# EAGLE design BLE-BMS (EAGLE 7.1.0)
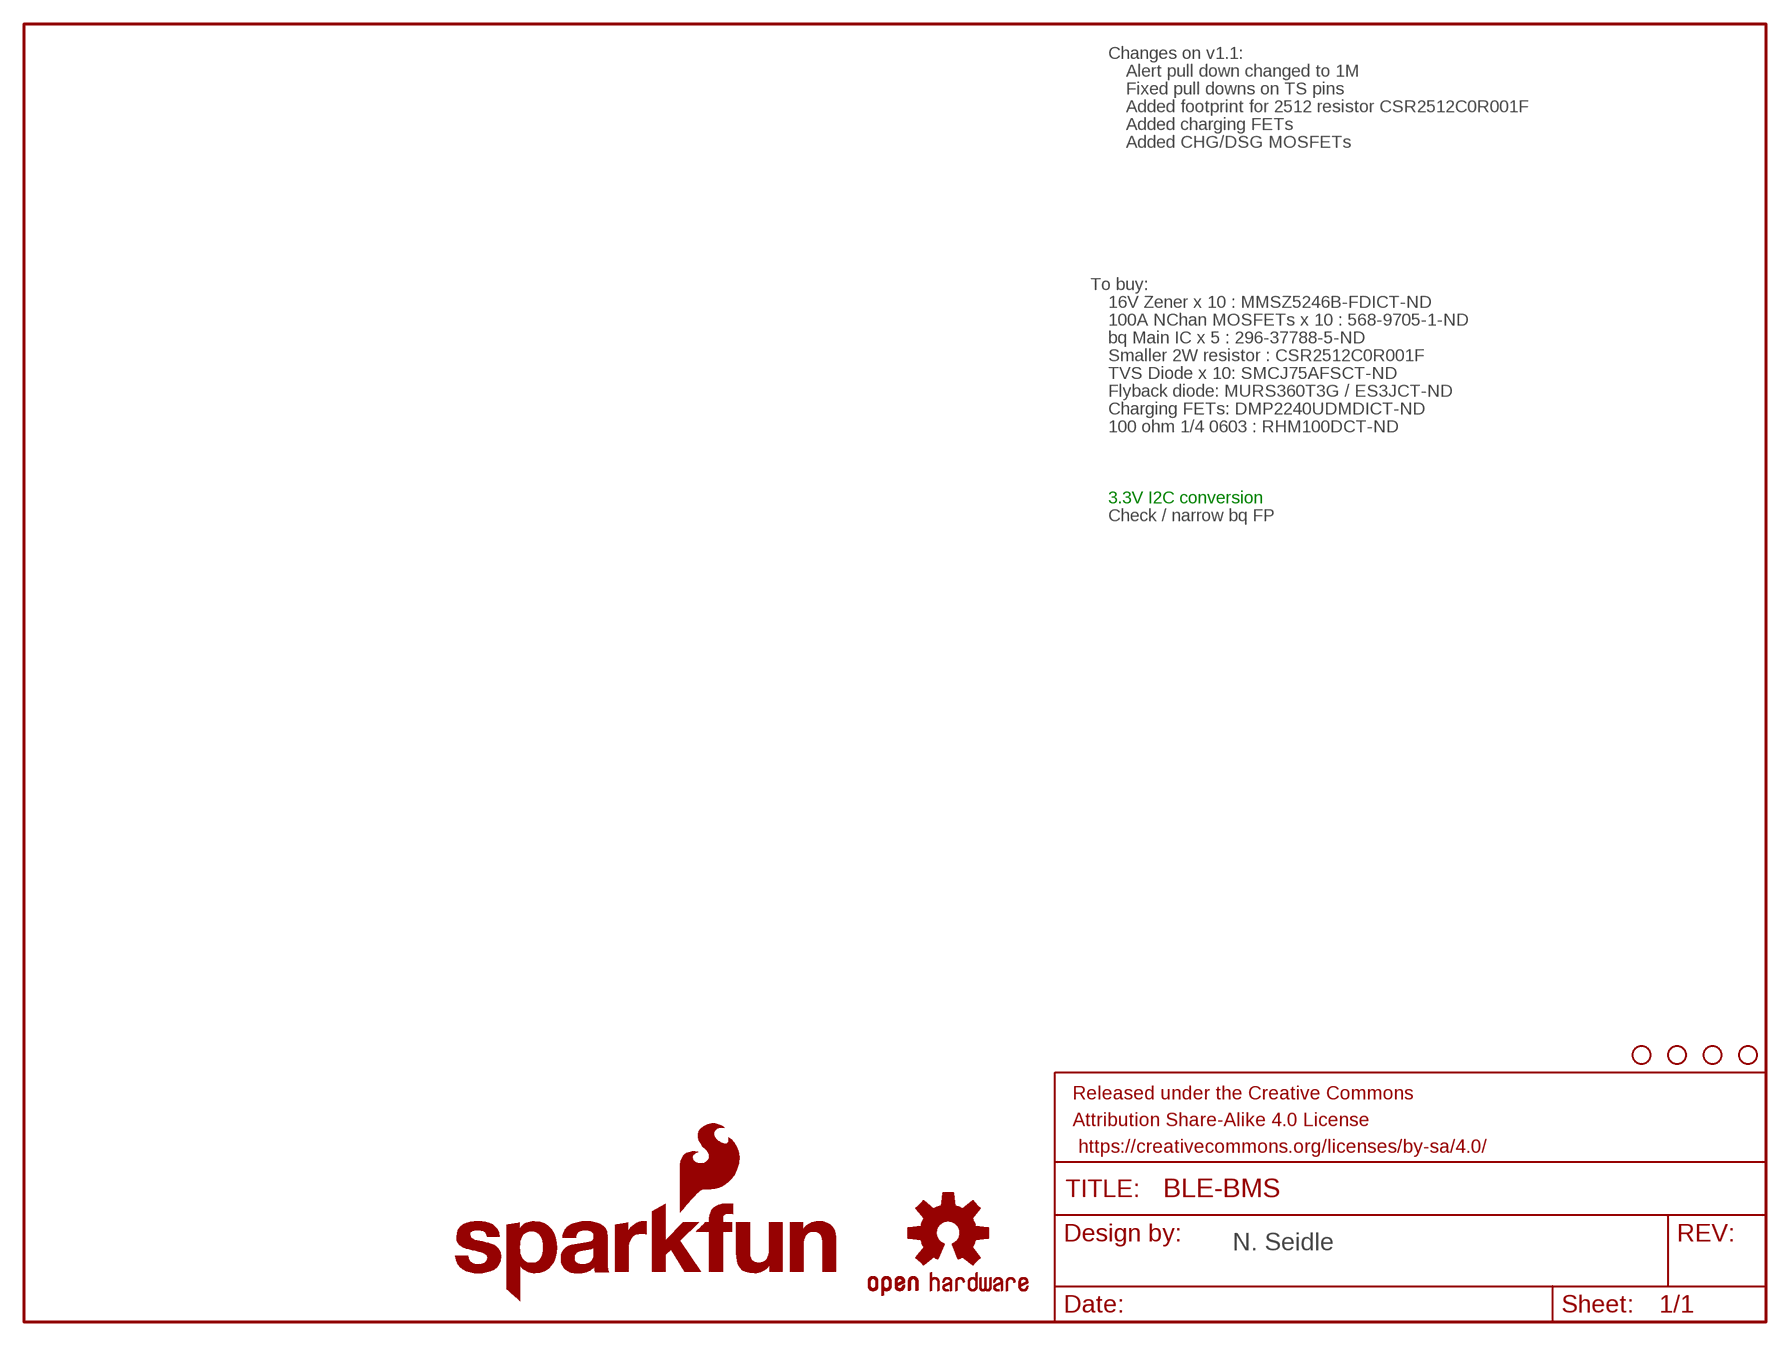
[diagram p0: schematic, sheet 1, part 1 of 3]
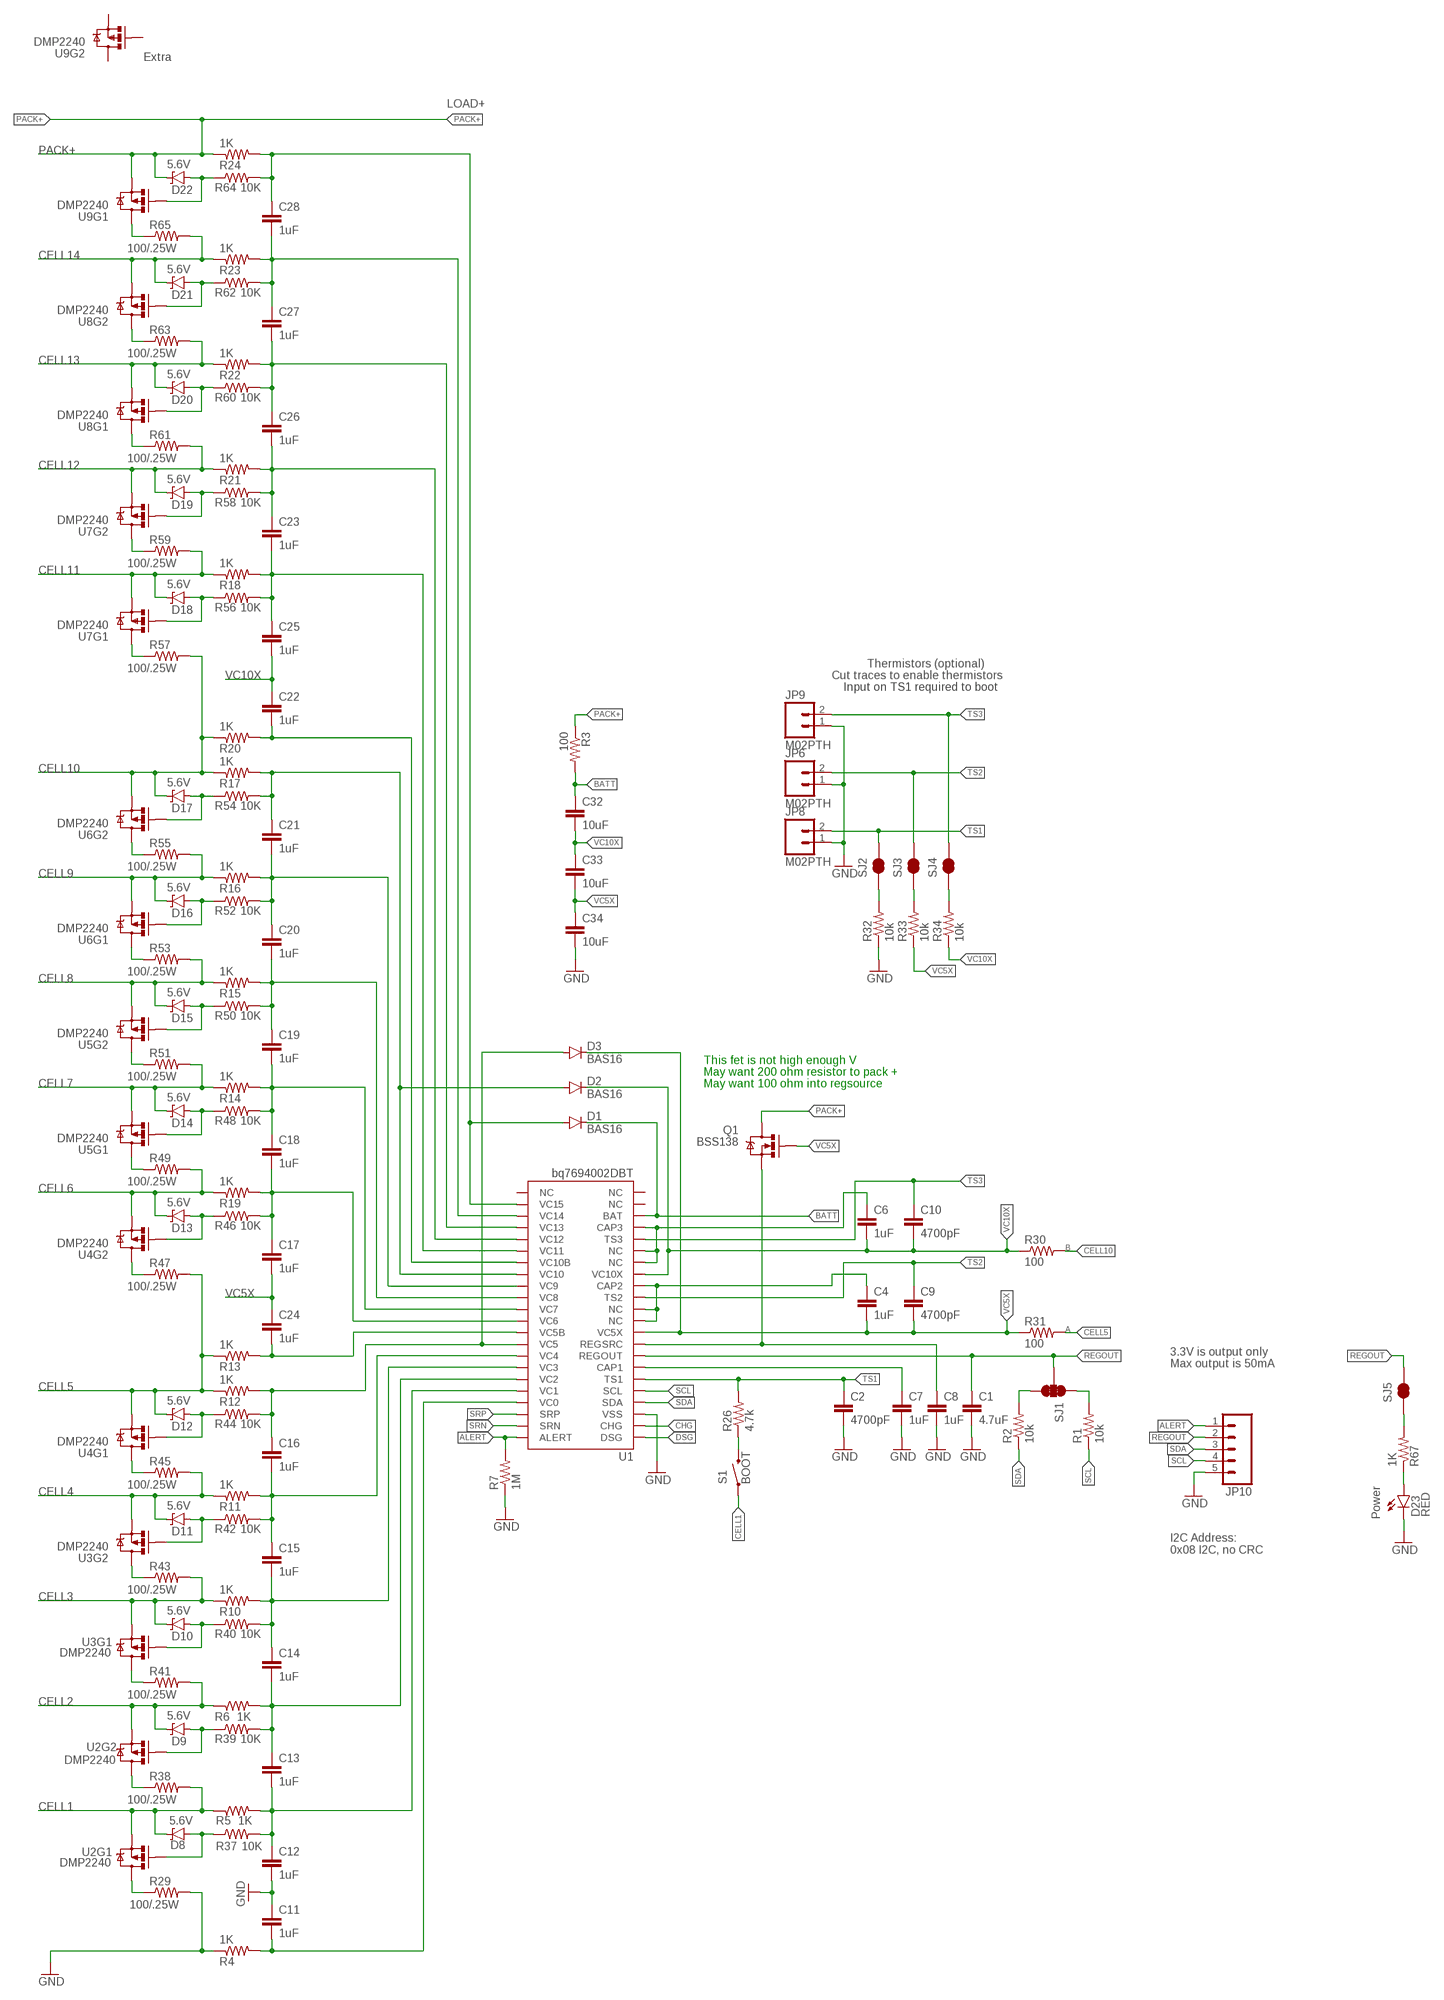
[diagram p1: schematic, sheet 1, part 2 of 3]
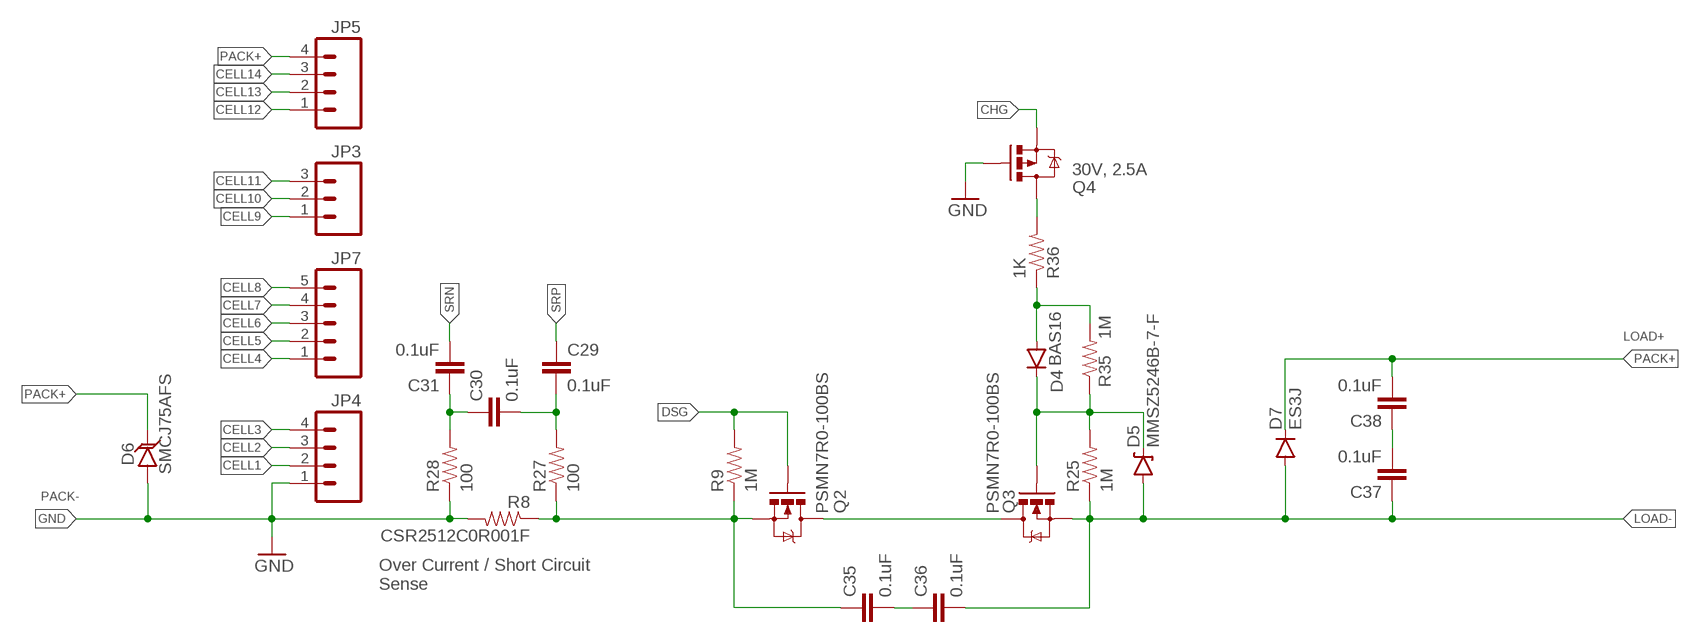
[diagram p2: schematic, sheet 1, part 3 of 3]

## Parts
C1  4.7uF  4.7UF-6.3V-10%(0603)0603  [0603-CAP]
C2  4700pF  4.7NF-50V-10%(0603)  [0603-CAP]
C4  1uF  1.0UF-16V-10%(0603)  [0603-CAP]
C6  1uF  1.0UF-16V-10%(0603)  [0603-CAP]
C7  1uF  1.0UF-16V-10%(0603)  [0603-CAP]
C8  1uF  1.0UF-16V-10%(0603)  [0603-CAP]
C9  4700pF  4.7NF-50V-10%(0603)  [0603-CAP]
C10  4700pF  4.7NF-50V-10%(0603)  [0603-CAP]
C11  1uF  1.0UF-16V-10%(0603)  [0603-CAP]
C12  1uF  1.0UF-16V-10%(0603)  [0603-CAP]
C13  1uF  1.0UF-16V-10%(0603)  [0603-CAP]
C14  1uF  1.0UF-16V-10%(0603)  [0603-CAP]
C15  1uF  1.0UF-16V-10%(0603)  [0603-CAP]
C16  1uF  1.0UF-16V-10%(0603)  [0603-CAP]
C17  1uF  1.0UF-16V-10%(0603)  [0603-CAP]
C18  1uF  1.0UF-16V-10%(0603)  [0603-CAP]
C19  1uF  1.0UF-16V-10%(0603)  [0603-CAP]
C20  1uF  1.0UF-16V-10%(0603)  [0603-CAP]
C21  1uF  1.0UF-16V-10%(0603)  [0603-CAP]
C22  1uF  1.0UF-16V-10%(0603)  [0603-CAP]
C23  1uF  1.0UF-16V-10%(0603)  [0603-CAP]
C24  1uF  1.0UF-16V-10%(0603)  [0603-CAP]
C25  1uF  1.0UF-16V-10%(0603)  [0603-CAP]
C26  1uF  1.0UF-16V-10%(0603)  [0603-CAP]
C27  1uF  1.0UF-16V-10%(0603)  [0603-CAP]
C28  1uF  1.0UF-16V-10%(0603)  [0603-CAP]
C29  0.1uF  0.1UF-25V(+80/-20%)(0603)  [0603-CAP]
C30  0.1uF  0.1UF-25V(+80/-20%)(0603)  [0603-CAP]
C31  0.1uF  0.1UF-25V(+80/-20%)(0603)  [0603-CAP]
C32  10uF  10UF50V20%(1210)  [1210]
C33  10uF  10UF50V20%(1210)  [1210]
C34  10uF  10UF50V20%(1210)  [1210]
C35  0.1uF  0.1UF-100V-10%(0603)  [0603-CAP]
C36  0.1uF  0.1UF-100V-10%(0603)  [0603-CAP]
C37  0.1uF  0.1UF-100V-10%(0603)  [0603-CAP]
C38  0.1uF  0.1UF-100V-10%(0603)  [0603-CAP]
D1  BAS16  DIODESOD  [SOD-323]
D2  BAS16  DIODESOD  [SOD-323]
D3  BAS16  DIODESOD  [SOD-323]
D4  BAS16  DIODESOD  [SOD-323]
D5  MMSZ5246B-7-F  DIODE-ZENERSOD-123  [SOD-123]
D6  SMCJ75AFS  TVSSMC  [SMC]
D7  ES3J  DIODESMC/DO-214AB  [SMC]
D8  5.6V  DIODE-ZENER3.3V  [SOD-323]
D9  5.6V  DIODE-ZENER3.3V  [SOD-323]
D10  5.6V  DIODE-ZENER3.3V  [SOD-323]
D11  5.6V  DIODE-ZENER3.3V  [SOD-323]
D12  5.6V  DIODE-ZENER3.3V  [SOD-323]
D13  5.6V  DIODE-ZENER3.3V  [SOD-323]
D14  5.6V  DIODE-ZENER3.3V  [SOD-323]
D15  5.6V  DIODE-ZENER3.3V  [SOD-323]
D16  5.6V  DIODE-ZENER3.3V  [SOD-323]
D17  5.6V  DIODE-ZENER3.3V  [SOD-323]
D18  5.6V  DIODE-ZENER3.3V  [SOD-323]
D19  5.6V  DIODE-ZENER3.3V  [SOD-323]
D20  5.6V  DIODE-ZENER3.3V  [SOD-323]
D21  5.6V  DIODE-ZENER3.3V  [SOD-323]
D22  5.6V  DIODE-ZENER3.3V  [SOD-323]
D23  RED  LED-RED1206  [LED-1206]
FRAME1  FRAME-LETTER  [CREATIVE_COMMONS]
JP3  M03JST-PTH  [JST-3-PTH]
JP4  M04JST-PTH  [JST-4-PTH]
JP5  M04JST-PTH  [JST-4-PTH]
JP6  M02PTH  [1X02]
JP7  M05JST  [JST-5-PTH]
JP8  M02PTH  [1X02]
JP9  M02PTH  [1X02]
JP10  M05PTH  [1X05]
LOGO1  SFE_LOGO_NAME_FLAME.1_INCH  [SFE_LOGO_NAME_FLAME_.1]
Q1  BSS138  MOSFET-NCHANNELBSS138  [SOT23-3]
Q2  PSMN7R0-100BS  MOSFET-NCHANNELPSMN7R0  [TO-263/D2PAK]
Q3  PSMN7R0-100BS  MOSFET-NCHANNELPSMN7R0  [TO-263/D2PAK]
Q4  30V, 2.5A  MOSFET-PCHANNELDMG2307L  [SOT23-3]
R1  10k  10KOHM1/10W1%(0603)0603  [0603-RES]
R2  10k  10KOHM1/10W1%(0603)0603  [0603-RES]
R3  100  100OHM1/10W1%(0603)  [0603-RES]
R4  1K  1KOHM1/10W1%(0603)  [0603-RES]
R5  1K  1KOHM1/10W1%(0603)  [0603-RES]
R6  1K  1KOHM1/10W1%(0603)  [0603-RES]
R7  1M  1MOHM1/10W1%(0603)  [0603-RES]
R8  CSR2512C0R001F  RESISTOR2512  [2512]
R9  1M  1MOHM1/10W1%(0603)  [0603-RES]
R10  1K  1KOHM1/10W1%(0603)  [0603-RES]
R11  1K  1KOHM1/10W1%(0603)  [0603-RES]
R12  1K  1KOHM1/10W1%(0603)  [0603-RES]
R13  1K  1KOHM1/10W1%(0603)  [0603-RES]
R14  1K  1KOHM1/10W1%(0603)  [0603-RES]
R15  1K  1KOHM1/10W1%(0603)  [0603-RES]
R16  1K  1KOHM1/10W1%(0603)  [0603-RES]
R17  1K  1KOHM1/10W1%(0603)  [0603-RES]
R18  1K  1KOHM1/10W1%(0603)  [0603-RES]
R19  1K  1KOHM1/10W1%(0603)  [0603-RES]
R20  1K  1KOHM1/10W1%(0603)  [0603-RES]
R21  1K  1KOHM1/10W1%(0603)  [0603-RES]
R22  1K  1KOHM1/10W1%(0603)  [0603-RES]
R23  1K  1KOHM1/10W1%(0603)  [0603-RES]
R24  1K  1KOHM1/10W1%(0603)  [0603-RES]
R25  1M  1MOHM1/10W1%(0603)  [0603-RES]
R26  4.7k  4.7KOHM1/10W1%(0603)  [0603-RES]
R27  100  100OHM1/10W1%(0603)  [0603-RES]
R28  100  100OHM1/10W1%(0603)  [0603-RES]
R29  100/.25W  100OHM1/10W1%(0603)  [0603-RES]
R30  100  100OHM1/10W1%(0603)  [0603-RES]
R31  100  100OHM1/10W1%(0603)  [0603-RES]
R32  10k  10KOHM1/10W1%(0603)0603  [0603-RES]
R33  10k  10KOHM1/10W1%(0603)0603  [0603-RES]
R34  10k  10KOHM1/10W1%(0603)0603  [0603-RES]
R35  1M  1MOHM1/10W1%(0603)  [0603-RES]
R36  1K  1KOHM1/10W1%(0603)  [0603-RES]
R37  10K  10KOHM1/10W1%(0603)0603  [0603-RES]
R38  100/.25W  100OHM1/10W1%(0603)  [0603-RES]
R39  10K  10KOHM1/10W1%(0603)0603  [0603-RES]
R40  10K  10KOHM1/10W1%(0603)0603  [0603-RES]
R41  100/.25W  100OHM1/10W1%(0603)  [0603-RES]
R42  10K  10KOHM1/10W1%(0603)0603  [0603-RES]
R43  100/.25W  100OHM1/10W1%(0603)  [0603-RES]
R44  10K  10KOHM1/10W1%(0603)0603  [0603-RES]
R45  100/.25W  100OHM1/10W1%(0603)  [0603-RES]
R46  10K  10KOHM1/10W1%(0603)0603  [0603-RES]
R47  100/.25W  100OHM1/10W1%(0603)  [0603-RES]
R48  10K  10KOHM1/10W1%(0603)0603  [0603-RES]
R49  100/.25W  100OHM1/10W1%(0603)  [0603-RES]
R50  10K  10KOHM1/10W1%(0603)0603  [0603-RES]
R51  100/.25W  100OHM1/10W1%(0603)  [0603-RES]
R52  10K  10KOHM1/10W1%(0603)0603  [0603-RES]
R53  100/.25W  100OHM1/10W1%(0603)  [0603-RES]
R54  10K  10KOHM1/10W1%(0603)0603  [0603-RES]
R55  100/.25W  100OHM1/10W1%(0603)  [0603-RES]
R56  10K  10KOHM1/10W1%(0603)0603  [0603-RES]
R57  100/.25W  100OHM1/10W1%(0603)  [0603-RES]
R58  10K  10KOHM1/10W1%(0603)0603  [0603-RES]
R59  100/.25W  100OHM1/10W1%(0603)  [0603-RES]
R60  10K  10KOHM1/10W1%(0603)0603  [0603-RES]
R61  100/.25W  100OHM1/10W1%(0603)  [0603-RES]
R62  10K  10KOHM1/10W1%(0603)0603  [0603-RES]
R63  100/.25W  100OHM1/10W1%(0603)  [0603-RES]
R64  10K  10KOHM1/10W1%(0603)0603  [0603-RES]
R65  100/.25W  100OHM1/10W1%(0603)  [0603-RES]
R67  1K  1KOHM1/10W1%(0603)  [0603-RES]
S1  BOOT  SWITCH-MOMENTARY-2-SMD-1101NE  [TACTILE-SWITCH-1101NE]
SJ1  JUMPER-PAD-3-NC_BY_TRACE  [PAD-JUMPER-3-3OF3_NC_BY_TRACE_YES_SILK_FULL_BOX]
SJ2  JUMPER-PAD-2-NC_BY_TRACE  [PAD-JUMPER-2-NC_BY_TRACE_YES_SILK]
SJ3  JUMPER-PAD-2-NC_BY_TRACE  [PAD-JUMPER-2-NC_BY_TRACE_YES_SILK]
SJ4  JUMPER-PAD-2-NC_BY_TRACE  [PAD-JUMPER-2-NC_BY_TRACE_YES_SILK]
SJ5  JUMPER-PAD-2-NC_BY_TRACE  [PAD-JUMPER-2-NC_BY_TRACE_YES_SILK]
STANDOFF1  STAND-OFF  [STAND-OFF]
STANDOFF2  STAND-OFF  [STAND-OFF]
STANDOFF3  STAND-OFF  [STAND-OFF]
STANDOFF4  STAND-OFF  [STAND-OFF]
U1  bq7694002DBT  BQ7694040  [44-TSSOP]
U2  DMP2240  MOSFET-PCHANNEL_DUALSOT26  [SOT26]
U3  DMP2240  MOSFET-PCHANNEL_DUALSOT26  [SOT26]
U4  DMP2240  MOSFET-PCHANNEL_DUALSOT26  [SOT26]
U5  DMP2240  MOSFET-PCHANNEL_DUALSOT26  [SOT26]
U6  DMP2240  MOSFET-PCHANNEL_DUALSOT26  [SOT26]
U7  DMP2240  MOSFET-PCHANNEL_DUALSOT26  [SOT26]
U8  DMP2240  MOSFET-PCHANNEL_DUALSOT26  [SOT26]
U9  DMP2240  MOSFET-PCHANNEL_DUALSOT26  [SOT26]
U$7  OSHW-LOGOS  [OSHW-LOGO-S]

## Nets
ALERT: JP10.1 R7.2 U1.44(ALERT)
BATT: C32.1 D1.C R3.2 U1.20(BAT)
CAP2: C4.1 U1.11(NC) U1.12(NC) U1.14(CAP2)
CAP3: C6.1 U1.16(NC) U1.17(NC) U1.19(CAP3)
CELL1: D8.C JP4.2 R5.1 R38.2 S1.1 U2.S1(S)
CELL2: D9.C JP4.3 R6.1 R41.2 U2.S2(S)
CELL3: D10.C JP4.4 R10.1 R43.2 U3.S1(S)
CELL4: D11.C JP7.1 R11.1 R45.2 U3.S2(S)
CELL5: D12.C JP7.2 R12.1 R13.1 R31.2 R47.2 U4.S1(S)
CELL6: D13.C JP7.3 R19.1 R49.2 U4.S2(S)
CELL7: D14.C JP7.4 R14.1 R51.2 U5.S1(S)
CELL8: D15.C JP7.5 R15.1 R53.2 U5.S2(S)
CELL9: D16.C JP3.1 R16.1 R55.2 U6.S1(S)
CELL10: D17.C JP3.2 R17.1 R20.1 R30.2 R57.2 U6.S2(S)
CELL11: D18.C JP3.3 R18.1 R59.2 U7.S1(S)
CELL12: D19.C JP5.1 R21.1 R61.2 U7.S2(S)
CELL13: D20.C JP5.2 R22.1 R63.2 U8.S1(S)
CELL14: D21.C JP5.3 R23.1 R65.2 U8.S2(S)
CHG: Q4.2(S) U1.2(CHG)
CHG_CTL: D4.C D5.C Q3.1(G) R25.2 R35.1
DSG: Q2.1(G) R9.2 U1.1(DSG)
GND: C1.2 C2.2 C7.2 C8.2 C11.1 C12.2 C34.2 D6.A D23.C JP4.1 JP6.1 JP8.1 JP9.1 JP10.5 Q4.1(G) R4.1 R7.1 R8.2 R28.1 R29.2 R32.1 U1.3(VSS)
LOAD1: Q2.2(D) Q3.2(D)
LOAD2: C35.1 Q2.3(S) R8.1 R9.1 R27.1
LOAD-: C36.2 C37.1 D5.A D7.A Q3.3(S) R25.1
N$1: D8.A R37.1 U2.G1(G)
N$2: Q4.3(D) R36.2
N$3: R32.2 SJ2.1
N$4: R29.1 U2.D1(D)
N$5: D9.A R39.1 U2.G2(G)
N$6: C35.2 C36.1
N$7: D4.A R35.2 R36.1
N$8: R38.1 U2.D2(D)
N$9: C37.2 C38.1
N$10: R2.2 SJ1.3
N$11: R1.2 SJ1.1
N$12: D10.A R40.1 U3.G1(G)
N$13: R41.1 U3.D1(D)
N$14: D11.A R42.1 U3.G2(G)
N$16: R43.1 U3.D2(D)
N$18: D12.A R44.1 U4.G1(G)
N$19: R45.1 U4.D1(D)
N$20: D13.A R46.1 U4.G2(G)
N$21: R47.1 U4.D2(D)
N$23: R49.1 U5.D1(D)
N$25: D14.A R48.1 U5.G1(G)
N$26: R51.1 U5.D2(D)
N$27: D15.A R50.1 U5.G2(G)
N$28: R33.2 SJ3.1
N$30: C7.1 U1.7(CAP1)
N$32: R26.1 S1.2
N$33: R34.2 SJ4.1
N$34: C29.2 C30.2 R27.2
N$35: C30.1 C31.1 R28.2
N$37: R53.1 U6.D1(D)
N$38: D16.A R52.1 U6.G1(G)
N$39: D17.A R54.1 U6.G2(G)
N$41: R55.1 U6.D2(D)
N$42: D18.A R56.1 U7.G1(G)
N$43: R57.1 U7.D1(D)
N$44: D19.A R58.1 U7.G2(G)
N$46: R59.1 U7.D2(D)
N$47: D20.A R60.1 U8.G1(G)
N$50: R61.1 U8.D1(D)
N$51: D21.A R62.1 U8.G2(G)
N$52: R63.1 U8.D2(D)
N$53: D22.A R64.1 U9.G1(G)
N$54: R65.1 U9.D1(D)
N$57: D23.A R67.1
N$58: R67.2 SJ5.1
PACK+: C38.2 D6.C D7.C D22.C JP5.4 Q1.3(D) R3.1 R24.1 U9.S1(S)
REGOUT: C1.1 JP10.2 SJ1.2 SJ5.2 U1.8(REGOUT)
REGSRC: C8.1 Q1.2(S) U1.9(REGSRC)
SCL: JP10.4 R1.1 U1.5(SCL)
SDA: JP10.3 R2.1 U1.4(SDA)
SRN: C31.2 U1.43(SRN)
SRP: C29.1 U1.42(SRP)
TS1: C2.1 JP8.2 R26.2 SJ2.2 U1.6(TS1)
TS2: C9.1 JP6.2 SJ3.2 U1.13(TS2)
TS3: C10.1 JP9.2 SJ4.2 U1.18(TS3)
VC0: C11.2 R4.2 U1.41(VC0)
VC1: C12.1 C13.2 R5.2 R37.2 U1.40(VC1)
VC2: C13.1 C14.2 R6.2 R39.2 U1.39(VC2)
VC3: C14.1 C15.2 R10.2 R40.2 U1.38(VC3)
VC4: C15.1 C16.2 R11.2 R42.2 U1.37(VC4)
VC5: C16.1 D3.A R12.2 R44.2 U1.36(VC5)
VC5B: C24.2 R13.2 U1.35(VC5B)
VC5X: C4.2 C9.2 C17.2 C24.1 C33.2 C34.1 D3.C Q1.1(G) R31.1 R33.1 U1.10(VC5X)
VC6: C17.1 C18.2 R19.2 R46.2 U1.34(VC6)
VC7: C18.1 C19.2 R14.2 R48.2 U1.33(VC7)
VC8: C19.1 C20.2 R15.2 R50.2 U1.32(VC8)
VC9: C20.1 C21.2 R16.2 R52.2 U1.31(VC9)
VC10: C21.1 D2.A R17.2 R54.2 U1.30(VC10)
VC10B: C22.2 R20.2 U1.29(VC10B)
VC10X: C6.2 C10.2 C22.1 C25.2 C32.2 C33.1 D2.C R30.1 R34.1 U1.15(VC10X)
VC11: C23.2 C25.1 R18.2 R56.2 U1.28(VC11)
VC12: C23.1 C26.2 R21.2 R58.2 U1.27(VC12)
VC13: C26.1 C27.2 R22.2 R60.2 U1.26(VC13)
VC14: C27.1 C28.2 R23.2 R62.2 U1.25(VC14)
VC15: C28.1 D1.A R24.2 R64.2 U1.24(VC15)
Unconnected: U1.21(NC) U1.22(NC) U1.23(NC) U9.D2(D) U9.G2(G) U9.S2(S)

## Notes on the sheet
- Extra
- LOAD+
- Thermistors (optional)
- Cut traces to enable thermistors
- Input on TS1 required to boot
- This fet is not high enough V
- May want 200 ohm resistor to pack +
- May want 100 ohm into regsource
- B
- A
- 3.3V is output only
- Max output is 50mA
- Power
- I2C Address:
  0x08 I2C, no CRC
- Changes on v1.1:
- Alert pull down changed to 1M
- Fixed pull downs on TS pins
- Added footprint for 2512 resistor CSR2512C0R001F
- Added charging FETs
- Added CHG/DSG MOSFETs
- To buy:
- 16V Zener x 10 : MMSZ5246B-FDICT-ND
- 100A NChan MOSFETs x 10 : 568-9705-1-ND
- bq Main IC x 5 : 296-37788-5-ND
- Smaller 2W resistor : CSR2512C0R001F
- TVS Diode x 10: SMCJ75AFSCT-ND
- Flyback diode: MURS360T3G / ES3JCT-ND
- Charging FETs: DMP2240UDMDICT-ND
- 100 ohm 1/4 0603 : RHM100DCT-ND
- 3.3V I2C conversion
- Check / narrow bq FP
- LOAD+
- PACK-
- Over Current / Short Circuit
  Sense
- N. Seidle

## Library data of the parts
C1 = SparkFun-Capacitors:4.7UF-6.3V-10%(0603): CAP-08280; PROD_ID: CAP-08280
C2 C9 C10 = SparkFun-Capacitors:4.7NF-50V-10%(0603): CAP-11378; PROD_ID: CAP-11378; VALUE: 4.7nF
C4 C6-C8 C11-C28 = SparkFun-Capacitors:1.0UF-16V-10%(0603): CAP-00868; PROD_ID: CAP-00868; VALUE: 1.0uF
C29-C31 = SparkFun-Capacitors:0.1UF-25V(+80/-20%)(0603): CAP-00810 Ceramic Standard decoupling cap; PROD_ID: CAP-00810
C32-C34 = SparkFun-Capacitors:10UF50V20%(1210): CAP-09824; PROD_ID: CAP-09824
C35-C38 = SparkFun-Capacitors:0.1UF-100V-10%(0603): CAP-08390; PROD_ID: CAP-08390
D1-D4 = SparkFun-DiscreteSemi:DIODE: Diode These are standard reverse protection diodes and small signal diodes. SMA package can handle up to about 1A. SOD-323 can handle about 200mA. What the SOD-323 package when ordering, there are some mfgs out there that are 5-pin packages.; PROD_ID: DIO-09646
D5 = SparkFun-DiscreteSemi:DIODE-ZENER: Zener Diode Production Part - 8199 3.4V Zener Voltage
D6 = SparkFun-DiscreteSemi:TVS: Transient voltage suppressor- prevents ESD on inputs.
D7 = SparkFun-DiscreteSemi:DIODE: Diode These are standard reverse protection diodes and small signal diodes. SMA package can handle up to about 1A. SOD-323 can handle about 200mA. What the SOD-323 package when ordering, there are some mfgs out there that are 5-pin packages.
D8-D22 = SparkFun-DiscreteSemi:DIODE-ZENER: Zener Diode Production Part - 8199 3.4V Zener Voltage; PROD_ID: DIO-11284; VALUE: 3.3V
D23 = SparkFun-LED:LED-RED: Assorted Red LEDs LilyPad 1206- DIO-09912 1206- DIO-00809 0603- DIO-00819; PROD_ID: DIO-00809
FRAME1 = SparkFun-Aesthetics:FRAME-LETTER: Schematic Frame Standard 8.5x11 US Letter frame
JP3 = SparkFun-Connectors:M03: Header 3 Standard 3-pin 0.1" header. Use with straight break away headers (SKU : PRT-00116), right angle break away headers (PRT-00553), swiss pins (PRT-00743), machine pins (PRT-00117), and female headers (PRT-00115). Molex polarized connector foot print use with SKU : PRT-08232 with associated crimp pins and housings.; SKU: PRT-09915
JP4 JP5 = SparkFun-Connectors:M04: Header 4 Standard 4-pin 0.1" header. Use with straight break away headers (SKU : PRT-00116), right angle break away headers (PRT-00553), swiss pins (PRT-00743), machine pins (PRT-00117), and female headers (PRT-00115). Molex polarized connector foot print use with SKU : PRT-08231 with associated crimp pins and housings. 1MM SMD Version SKU: PRT-10208; SKU: PRT-09916
JP6 JP8 JP9 = SparkFun-Connectors:M02: Standard 2-pin 0.1" header. Use with - straight break away headers ( PRT-00116) - right angle break away headers (PRT-00553) - swiss pins (PRT-00743) - machine pins (PRT-00117) - female headers (PRT-00115) Molex polarized connector foot print use with: PRT-08233 with associated crimp pins and housings. 2.54_SCREWTERM for use with PRT-10571. 3.5mm Screw Terminal footprints for PRT-08084 5mm Screw Terminal footprints for use with PRT-08432
JP7 JP10 = SparkFun-Connectors:M05: Header 5 Standard 5-pin 0.1" header. Use with straight break away headers (SKU : PRT-00116), right angle break away headers (PRT-00553), swiss pins (PRT-00743), machine pins (PRT-00117), and female headers (PRT-00115). Molex polarized connector foot print use with SKU : PRT-08230 with associated crimp pins and housings.
LOGO1 = SparkFun-Aesthetics:SFE_LOGO_NAME_FLAME: SFE Logo, name and flame This is the SparkFun full logo. The logo on the schematic will always be the same size; the package variant is the height of the flame part of the logo. Default layer for the logo on the board is tSilk.
Q1 = SparkFun-DiscreteSemi:MOSFET-NCHANNEL: Common NMOSFET Parts MFG P/N Store ID Prod ID FDD8780 TRANS-09984 SI7820DN TRANS-11055 FDS6630A IC-08089 2N7002PW TRANS-11151 FQP30N06L COM-10213 TRANS-10060 BSS123LT1G TRANS-08345 BSS138 TRANS-00830 BS170 2N7000; PROD_ID: TRANS-00830
Q2 Q3 = SparkFun-DiscreteSemi:MOSFET-NCHANNEL: Common NMOSFET Parts MFG P/N Store ID Prod ID FDD8780 TRANS-09984 SI7820DN TRANS-11055 FDS6630A IC-08089 2N7002PW TRANS-11151 FQP30N06L COM-10213 TRANS-10060 BSS123LT1G TRANS-08345 BSS138 TRANS-00830 BS170 2N7000
Q4 = SparkFun-DiscreteSemi:MOSFET-PCHANNEL: Generic PMOSFET IRLML2244 - TRANS-11153 (SOT-23 -20V -4.3A) (1.Gate 2.Source 3.Drain) FQP27P06 - COM-10349 <http://www.sparkfun.com/products/10349> (TO-220 -60V -27A) (1.Gate 2.Source 3.Drain); PROD_ID: TRANS-11308
R1 R2 R32-R34 = SparkFun-Resistors:10KOHM1/10W1%(0603): RES-00824; PROD_ID: RES-00824; VALUE: 10K
R3 R27 R28 R30 R31 = SparkFun-Resistors:100OHM1/10W1%(0603): RES-07863; PROD_ID: RES-07863
R4-R6 R10-R24 R36 R67 = SparkFun-Resistors:1KOHM1/10W1%(0603): RES-07856; PROD_ID: RES-07856
R7 R9 R25 R35 = SparkFun-Resistors:1MOHM1/10W1%(0603): RES-07868; PROD_ID: RES-07868
R8 = bq769x0:RESISTOR
R26 = SparkFun-Resistors:4.7KOHM1/10W1%(0603): RES-07857; PROD_ID: RES-07857; VALUE: 4.7K
R29 R38 R41 R43 R45 R47 R49 R51 R53 R55 R57 R59 R61 R63 R65 = SparkFun-Resistors:100OHM1/10W1%(0603): RES-07863; PROD_ID: RES-07863; VALUE: 100
R37 R39 R40 R42 R44 R46 R48 R50 R52 R54 R56 R58 R60 R62 R64 = SparkFun-Resistors:10KOHM1/10W1%(0603): RES-00824; PROD_ID: RES-00824
S1 = SparkFun-Electromechanical:SWITCH-MOMENTARY-2: Various NO switches- pushbuttons, reed, etc
SJ1 = SparkFun-Passives:JUMPER-PAD-3-NC_BY_TRACE
SJ2-SJ5 = SparkFun-Passives:JUMPER-PAD-2-NC_BY_TRACE
STANDOFF1-STANDOFF4 = SparkFun-Electromechanical:STAND-OFF: #4 Stand Off This is the mechanical footprint for a #4 phillips button head screw. Use the keepout ring to avoid running the screw head into surrounding components. SKU : PRT-00447
U1 = bq769x0:BQ76940: Description: bq769x0 from TI is a multi-cell battery monitoring chipset. It's fairly complex but has lots of useful features. Currently footprint and symbol are unproven.
U2-U9 = SparkFun-DiscreteSemi:MOSFET-PCHANNEL_DUAL
U$7 = SparkFun-Aesthetics:OSHW-LOGO: Open Source Hardware Logo This logo indicates the piece of hardware it is found on incorporates a OSHW license and/or adheres to the definition of open source hardware found here: http://freedomdefined.org/OSHW

## Net classes
1 LOAD1: width 1.27 mm
2 LOAD2: width 1.27 mm
3 LOAD-: width 1.27 mm

## Board
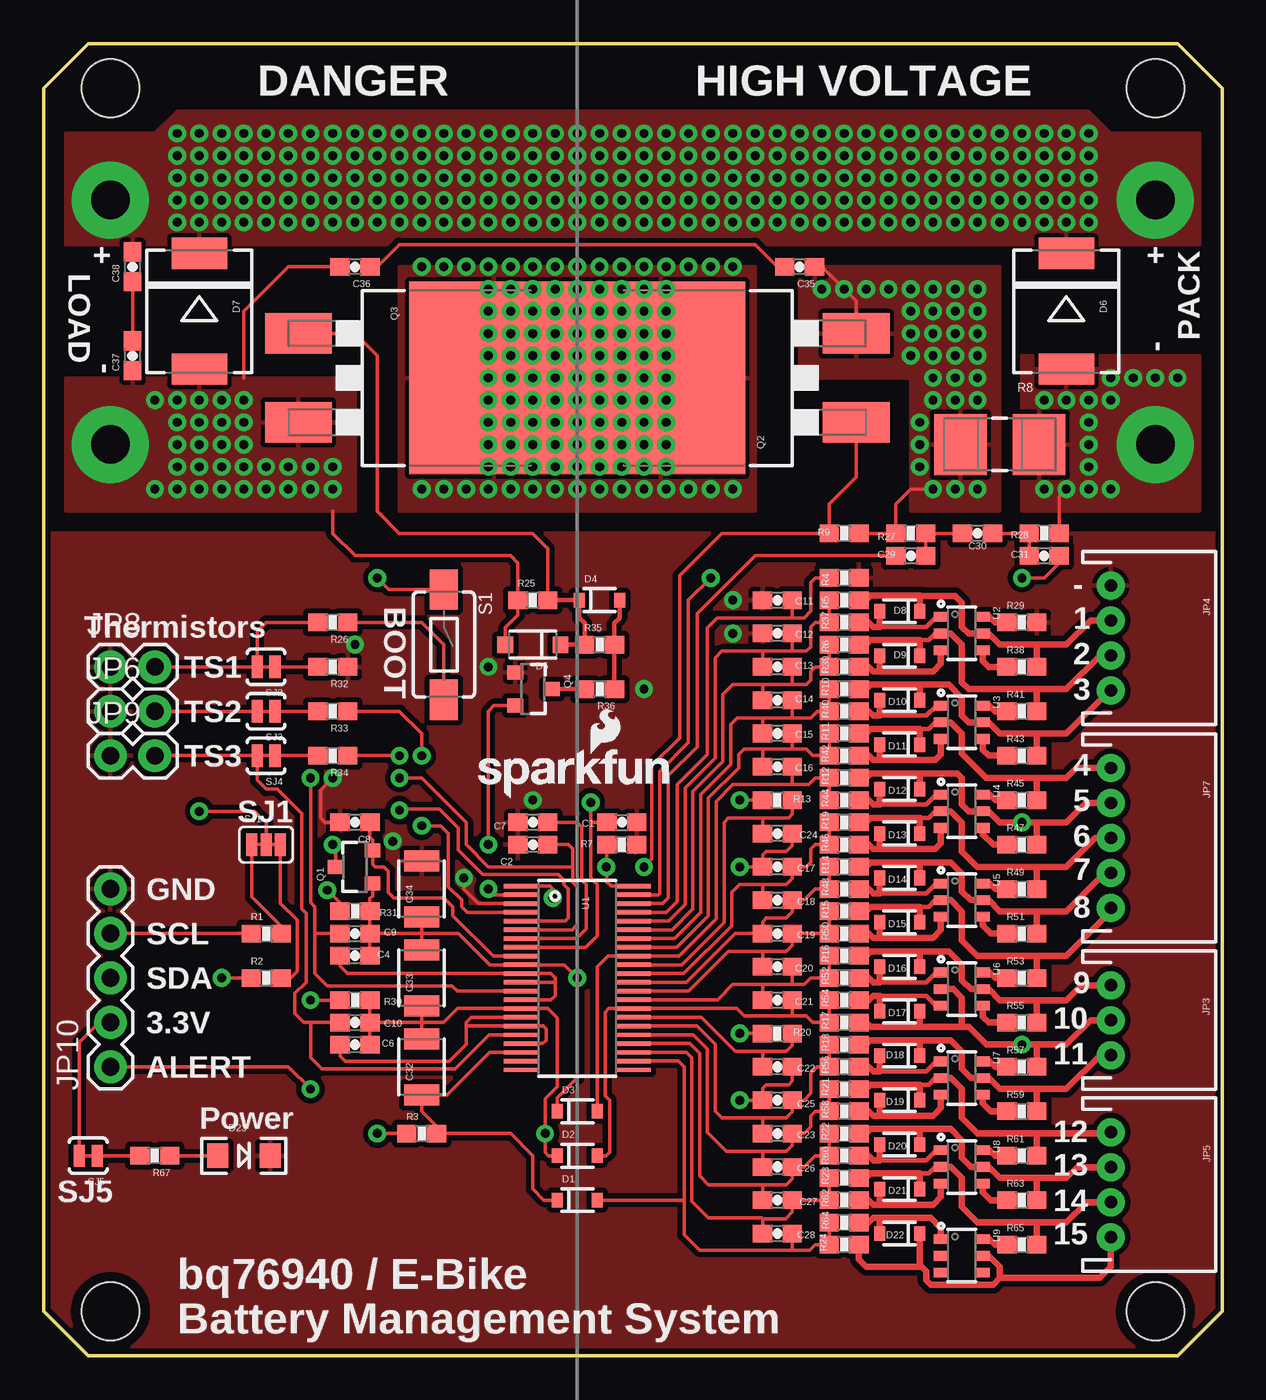
[diagram p3: board, top side]
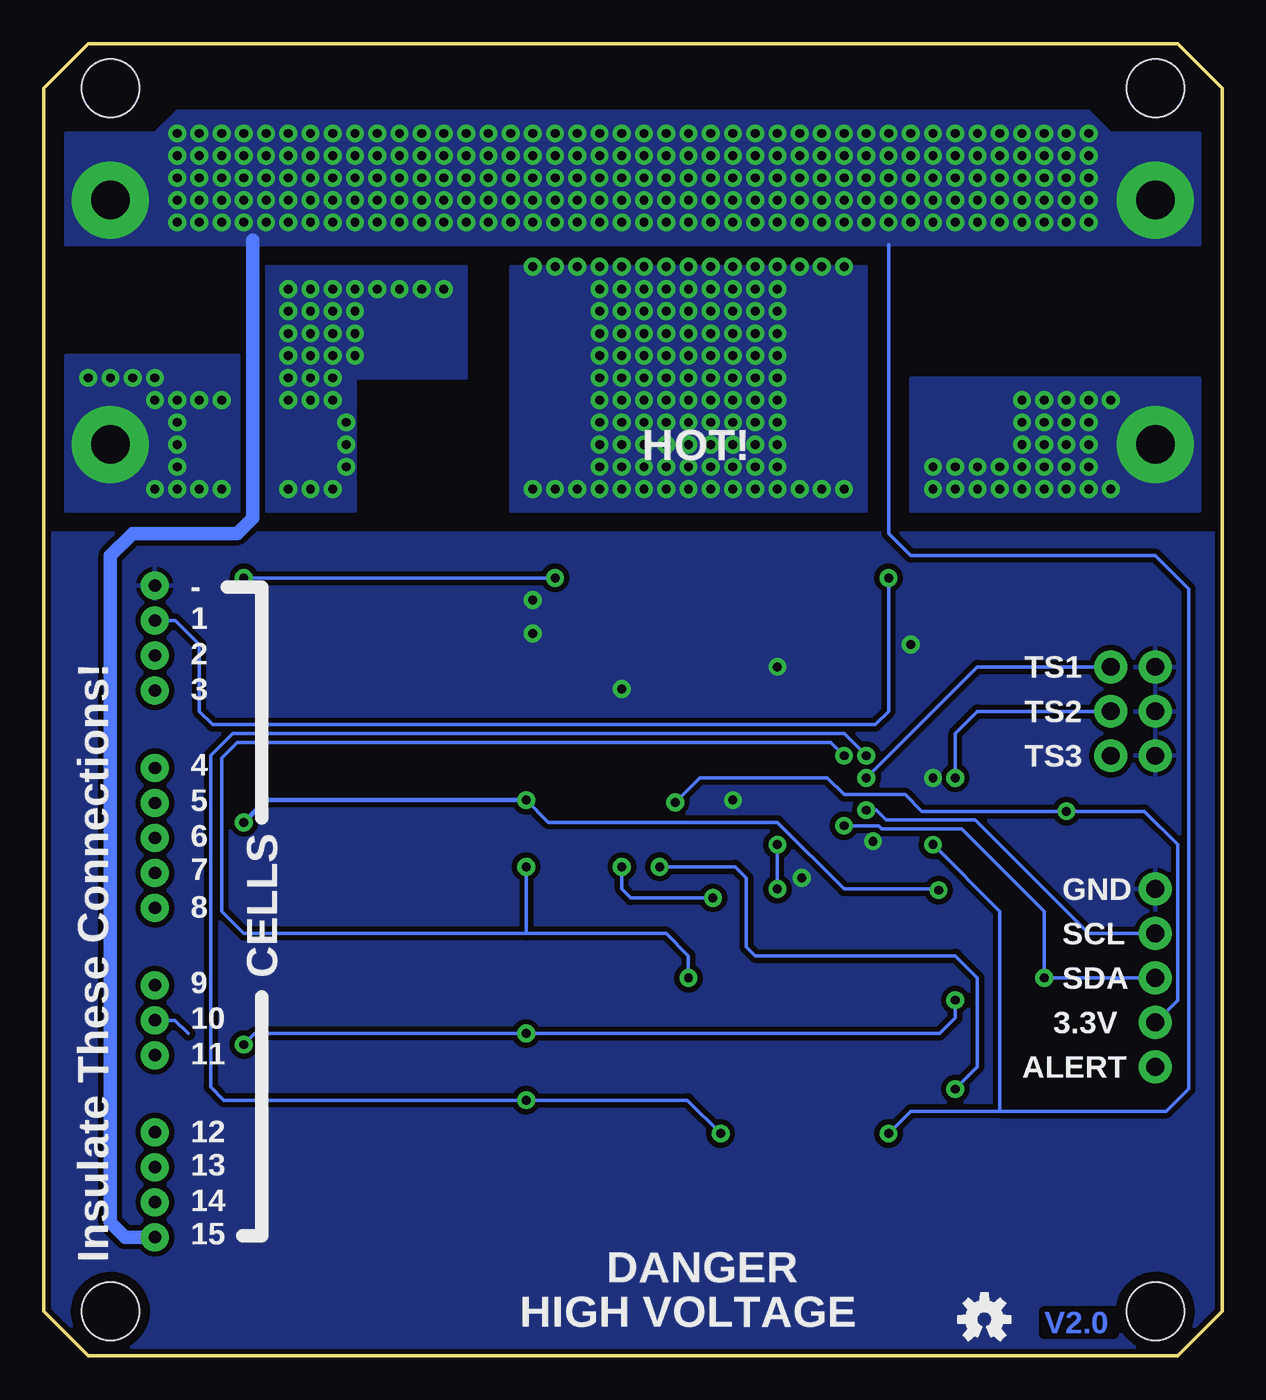
[diagram p4: board, bottom side, seen from below]

Size 67.31 x 74.98 mm. Coordinates in mm from the lower left corner, seen from the top.
Outline: 0,72.44 2.54,74.98 64.77,74.98 67.31,72.44 67.31,2.54 64.77,0 2.54,0 0,2.54 0,72.44
Copper layers (1*16): Top 0.035mm / dielectric 1.5mm / Bottom 0.035mm
Design rules "default *": minimum track width 8mil, minimum drill 20mil, track to track 8mil, track to pad 8mil, pad to pad 8mil, via to via 8mil, smd to smd 8mil, copper to edge 8mil, drill to drill 8mil, minimum pad ring 12mil, minimum via ring 10mil, stop-mask expansion 4mil, vias tented up to drill 20mil, thermal gap 10mil

### Footprints (pad centres in the part's own frame; a part is rotated, then mirrored left to right if it is on the bottom)
0603-CAP = smd 1.1 x 1: 1 -0.85,0; 2 0.85,0
1210 = smd 1.2 x 2: 1 -1.6,0; 2 1.6,0
SOD-323 = smd 0.63 x 0.83: A 1.15,0; C -1.15,0
SOD-123 = smd 0.9 x 0.95: A 1.575,0; C -1.575,0
SMC = smd 1.778 x 3.175: A 3.302,0; C -3.302,0
LED-1206 = smd 1.2 x 1.4: A -1.5,0; C 1.5,0
JST-3-PTH = drill 0.7 pad 1.6: 1 -2,0; 2 0,0; 3 2,0
JST-4-PTH = drill 0.7 pad 1.6: 1 -3,0; 2 -1,0; 3 1,0; 4 3,0
1X02 = drill 1.016 pad 1.88: 1 0,0; 2 2.54,0
JST-5-PTH = drill 0.7 pad 1.6: 1 -4,0; 2 -2,0; 3 0,0; 4 2,0; 5 4,0
1X05 = drill 1.016 pad 1.88: 1 0,0; 2 2.54,0; 3 5.08,0; 4 7.62,0; 5 10.16,0
SOT23-3 = smd 0.8 x 0.9: 1 -0.95,-1; 2 0.95,-1; 3 0,1.1
TO-263/D2PAK = smd 2.32 x 3.81: 1 -2.54,-7.045; 3 2.54,-7.045 | smd 11 x 9.65: 2 0,4.125
0603-RES = smd 1.1 x 1: 1 -0.85,0; 2 0.85,0
2512 = smd 3 x 3.5: 1 -2.25,0; 2 2.25,0
TACTILE-SWITCH-1101NE = smd 2.3 x 1.6: 1 -3.15,0; 2 3.15,0
PAD-JUMPER-3-3OF3_NC_BY_TRACE_YES_SILK_FULL_BOX = smd 0.635 x 1.27: 1 -0.813,0; 2 0,0; 3 0.813,0
PAD-JUMPER-2-NC_BY_TRACE_YES_SILK = smd 0.635 x 1.27: 1 -0.508,0; 2 0.508,0
STAND-OFF = hole 3.302: 0,0
44-TSSOP = smd 2 x 0.25: 1 -3.2,5.25; 2 -3.2,4.75; 3 -3.2,4.25; 4 -3.2,3.75; 5 -3.2,3.25; 6 -3.2,2.75; 7 -3.2,2.25; 8 -3.2,1.75; 9 -3.2,1.25; 10 -3.2,0.75; 11 -3.2,0.25; 12 -3.2,-0.25; 13 -3.2,-0.75; 14 -3.2,-1.25; 15 -3.2,-1.75; 16 -3.2,-2.25; 17 -3.2,-2.75; 18 -3.2,-3.25; 19 -3.2,-3.75; 20 -3.2,-4.25; 21 -3.2,-4.75; 22 -3.2,-5.25; 23 3.2,-5.25; 24 3.2,-4.75; 25 3.2,-4.25; 26 3.2,-3.75; 27 3.2,-3.25; 28 3.2,-2.75; 29 3.2,-2.25; 30 3.2,-1.75; 31 3.2,-1.25; 32 3.2,-0.75; 33 3.2,-0.25; 34 3.2,0.25; 35 3.2,0.75; 36 3.2,1.25; 37 3.2,1.75; 38 3.2,2.25; 39 3.2,2.75; 40 3.2,3.25; 41 3.2,3.75; 42 3.2,4.25; 43 3.2,4.75; 44 3.2,5.25
SOT26 = smd 0.55 x 0.8: D1 -0.95,1.2; D2 0.95,1.2; G1 -0.95,-1.2; G2 0.95,-1.2; S1 0,1.2; S2 0,-1.2

### Placement (x,y rotation side)
C1  33.02,30.48 0 top
C2  27.94,29.21 180 top
C4  17.78,22.86 0 top
C6  17.78,17.78 0 top
C7  27.94,30.48 180 top
C8  17.78,30.48 180 top
C9  17.78,24.13 0 top
C10  17.78,19.05 0 top
C11  41.91,43.18 0 top
C12  41.91,41.27 180 top
C13  41.91,39.37 180 top
C14  41.91,37.47 180 top
C15  41.91,35.56 180 top
C16  41.91,33.66 180 top
C17  41.91,27.94 180 top
C18  41.91,26.04 180 top
C19  41.91,24.13 180 top
C20  41.91,22.23 180 top
C21  41.91,20.32 180 top
C22  41.91,16.51 180 top
C23  41.91,12.7 180 top
C24  41.91,29.84 180 top
C25  41.91,14.61 180 top
C26  41.91,10.79 180 top
C27  41.91,8.89 180 top
C28  41.91,6.99 180 top
C29  49.53,45.72 0 top
C30  53.34,46.99 180 top
C31  57.15,45.72 0 top
C32  21.59,16.51 90 top
C33  21.59,21.59 90 top
C34  21.59,26.67 90 top
C35  43.18,62.23 180 top
C36  17.78,62.23 180 top
C37  5.08,57.15 90 top
C38  5.08,62.23 90 top
D1  30.48,8.89 0 top
D2  30.48,11.43 0 top
D3  30.48,13.97 0 top
D4  31.75,43.18 0 top
D5  27.94,40.64 180 top
D6  58.42,59.69 270 top
D7  8.89,59.69 270 top
D8  48.9,42.55 180 top
D9  48.9,40.01 180 top
D10  48.9,37.47 180 top
D11  48.9,34.92 180 top
D12  48.9,32.38 180 top
D13  48.9,29.84 180 top
D14  48.9,27.3 180 top
D15  48.9,24.77 180 top
D16  48.9,22.23 180 top
D17  48.9,19.68 180 top
D18  48.9,17.14 180 top
D19  48.9,14.61 180 top
D20  48.9,12.06 180 top
D21  48.9,9.53 180 top
D22  48.9,6.99 180 top
D23  11.43,11.43 0 top
FRAME1  -0.65,-21.59 0 top  (outside the outline)
JP3  60.96,19.18 270 top
JP4  60.96,41.02 270 top
JP5  60.96,9.78 270 top
JP6  3.81,36.83 0 top
JP7  60.96,29.59 270 top
JP8  3.81,39.37 0 top
JP9  3.81,34.29 0 top
JP10  3.81,16.51 90 top
LOGO1  24.38,31.75 0 top
Q1  17.78,27.94 90 top
Q2  39.37,55.88 90 top
Q3  21.59,55.88 270 top
Q4  27.94,38.1 270 top
R1  12.7,24.13 0 top
R2  12.7,21.59 0 top
R3  21.59,12.7 0 top
R4  45.72,44.45 180 top
R5  45.72,43.18 180 top
R6  45.72,40.64 180 top
R7  33.02,29.21 180 top
R8  54.61,52.07 0 top
R9  45.72,46.99 180 top
R10  45.72,38.1 180 top
R11  45.72,35.56 180 top
R12  45.72,33.02 180 top
R13  41.91,31.75 0 top
R14  45.72,27.94 180 top
R15  45.72,25.4 180 top
R16  45.72,22.86 180 top
R17  45.72,19.05 180 top
R18  45.72,17.78 180 top
R19  45.72,30.48 180 top
R20  41.91,18.41 0 top
R21  45.72,15.24 180 top
R22  45.72,12.7 180 top
R23  45.72,10.16 180 top
R24  45.72,6.35 180 top
R25  27.94,43.18 0 top
R26  16.51,41.91 180 top
R27  49.53,46.99 0 top
R28  57.15,46.99 180 top
R29  55.88,41.91 0 top
R30  17.78,20.32 180 top
R31  17.78,25.4 180 top
R32  16.51,39.37 180 top
R33  16.51,36.83 180 top
R34  16.51,34.29 180 top
R35  31.75,40.64 0 top
R36  31.75,38.1 180 top
R37  45.72,41.91 180 top
R38  55.88,39.37 0 top
R39  45.72,39.37 180 top
R40  45.72,36.83 180 top
R41  55.88,36.83 0 top
R42  45.72,34.29 180 top
R43  55.88,34.29 0 top
R44  45.72,31.75 180 top
R45  55.88,31.75 0 top
R46  45.72,29.21 180 top
R47  55.88,29.21 0 top
R48  45.72,26.67 180 top
R49  55.88,26.67 0 top
R50  45.72,24.13 180 top
R51  55.88,24.13 0 top
R52  45.72,21.59 180 top
R53  55.88,21.59 0 top
R54  45.72,20.32 180 top
R55  55.88,19.05 0 top
R56  45.72,16.51 180 top
R57  55.88,16.51 0 top
R58  45.72,13.97 180 top
R59  55.88,13.97 0 top
R60  45.72,11.43 180 top
R61  55.88,11.43 0 top
R62  45.72,8.89 180 top
R63  55.88,8.89 0 top
R64  45.72,7.62 180 top
R65  55.88,6.35 0 top
R67  6.35,11.43 180 top
S1  22.86,40.64 270 top
SJ1  12.7,29.21 0 top
SJ2  12.7,39.37 180 top
SJ3  12.7,36.83 180 top
SJ4  12.7,34.29 180 top
SJ5  2.54,11.43 180 top
STANDOFF1  3.81,2.54 0 top
STANDOFF2  63.5,2.54 0 top
STANDOFF3  3.81,72.44 0 top
STANDOFF4  63.5,72.44 0 top
U1  30.48,21.59 0 top
U2  52.45,41.27 270 top
U3  52.45,36.2 270 top
U4  52.45,31.11 270 top
U5  52.45,26.04 270 top
U6  52.45,20.95 270 top
U7  52.45,15.88 270 top
U8  52.45,10.79 270 top
U9  52.45,5.71 270 top
U$7  13.58,2.08 0 bottom

### Tracks (layer width: path | path; a pad name or v marks a point on that pad's centre or on a via)
ALERT  (via drill 0.51)
  Top 0.203: 32.17,27.94 v32.13,27.94 | 32.17,27.94 32.17,27.08 32.41,26.84 U1.44 | 32.17,27.94 R7.2 | JP10.1 13.97,16.51 v15.24,15.24
  Bottom 0.203: v32.13,27.94 27.81,27.94 27.18,27.3 27.18,23.37 26.67,22.86 15.24,22.86 13.97,21.59 13.97,16.51 v15.24,15.24
BATT
  Top 0.203: D1.C 28.57,8.89 27.94,9.53 27.94,11.43 26.67,12.7 R3.2 22.44,13.12 21.59,13.97 C32.1 23.04,14.91 25.47,17.34 U1.20
CAP2
  Top 0.203: 29.21,21.34 29.21,21.59 28.96,21.84 U1.11 17.34,21.84 16.93,22.25 C4.1 | 29.21,21.34 29.21,20.57 28.98,20.34 U1.14 | U1.12 29.21,21.34
CAP3
  Top 0.203: U1.16 24.42,19.34 24.13,19.05 24.13,18.8 | 24.13,18.8 24.13,17.78 23.18,16.83 17.21,16.83 16.93,17.11 C6.1 | 24.13,18.8 24.17,18.84 U1.17 28.53,18.84 28.7,18.67 28.7,18.03 28.51,17.84 U1.19
CELL1  (via drill 0.51)
  Top 0.203: S1.1 19.71,43.79 v19.05,44.45
  Top 0.381: R5.1 46.99,43.18 47.24,43.43 50.04,43.43 50.05,43.43 | 56.77,40.64 54.61,40.64 53.98,41.27 U2.S1 52.83,41.27 52.45,41.66 52.45,43.05 52.08,43.43 50.05,43.43 | R38.2 56.73,40.6 56.77,40.64 | D8.C 50.05,43.43 | 56.77,40.64 58.42,40.64 59.8,42.02 JP4.2
  Bottom 0.203: v19.05,44.45 19.05,36.83 19.81,36.07 57.66,36.07 58.42,36.83 58.42,40.64 59.8,42.02 JP4.2
CELL2
  Top 0.254: 50.04,40.89 50.55,40.89 50.93,41.27 U2.S2
  Top 0.381: R6.1 46.99,40.64 47.24,40.89 50.04,40.89 50.05,40.89 D9.C | U2.S2 51.82,41.27 52.45,40.64 52.45,38.48 52.83,38.1 56.77,38.1 | 56.77,38.1 58.42,38.1 60.34,40.02 JP4.3 | R41.2 56.73,38.06 56.77,38.1
CELL3
  Top 0.381: R10.1 46.99,38.1 47.24,38.35 50.04,38.35 | 50.04,38.35 51.69,38.35 52.45,37.59 52.45,36.58 52.83,36.2 U3.S1 53.98,36.2 54.61,35.56 56.77,35.56 | D10.C 50.05,38.35 50.04,38.35 | JP4.4 60.88,38.02 58.42,35.56 56.77,35.56 | R43.2 56.73,35.52 56.77,35.56
CELL4
  Top 0.254: 50.04,35.81 50.55,35.81 50.93,36.2 U3.S2
  Top 0.381: R11.1 46.99,35.56 47.24,35.81 50.04,35.81 50.05,35.81 D11.C | U3.S2 51.82,36.2 52.45,35.56 52.45,34.42 53.85,33.02 56.77,33.02 | 56.77,33.02 58.42,33.02 58.99,33.59 JP7.1 | R45.2 56.73,32.98 56.77,33.02
CELL5  (via drill 0.51)
  Top 0.203: R31.2 16.93,25.87 v16.19,26.61 | R13.1 v39.75,31.75
  Top 0.381: 56.77,30.48 v55.88,30.48 54.61,30.48 53.98,31.11 U4.S1 52.83,31.11 52.45,31.5 52.45,33.02 52.2,33.27 50.04,33.27 | 56.77,30.48 58.42,30.48 59.53,31.59 JP7.2 | R47.2 56.73,30.44 56.77,30.48 | R12.1 46.99,33.02 47.24,33.27 50.04,33.27 | D12.C 50.05,33.27 50.04,33.27
  Bottom 0.203: v16.19,26.61 16.26,26.67 21.59,26.67 25.4,30.48 38.48,30.48 v39.75,31.75 | 60.8,31.75 JP7.2
  Bottom 0.254: v39.75,31.75 54.61,31.75 v55.88,30.48
CELL6
  Top 0.254: 50.04,30.73 50.55,30.73 50.93,31.11 U4.S2
  Top 0.381: R19.1 46.99,30.48 47.24,30.73 50.04,30.73 50.05,30.73 D13.C | U4.S2 51.82,31.11 52.45,30.48 52.45,28.83 53.34,27.94 56.77,27.94 | 56.77,27.94 58.42,27.94 60.07,29.59 JP7.3 | R49.2 56.73,27.9 56.77,27.94
CELL7
  Top 0.381: R14.1 46.99,27.94 47.24,28.19 50.04,28.19 | 50.04,28.19 51.82,28.19 52.45,27.56 52.45,26.54 52.96,26.04 U5.S1 53.98,26.04 54.61,25.4 56.77,25.4 | D14.C 50.05,28.19 50.04,28.19 | 56.77,25.4 58.42,25.4 60.61,27.59 JP7.4 | R51.2 56.73,25.36 56.77,25.4
CELL8
  Top 0.254: 50.04,25.65 50.55,25.65 50.93,26.04 U5.S2
  Top 0.381: R15.1 46.99,25.4 47.24,25.65 50.04,25.65 50.05,25.65 D15.C | U5.S2 51.82,26.04 52.45,25.4 52.45,23.75 53.34,22.86 56.77,22.86 | R53.2 56.73,22.82 56.77,22.86 | 56.77,22.86 58.42,22.86 60.96,25.4 JP7.5
CELL9
  Top 0.381: R16.1 46.99,22.86 47.24,23.11 50.04,23.11 | 50.04,23.11 51.69,23.11 52.45,22.35 52.45,21.46 52.96,20.95 U6.S1 53.98,20.95 54.61,20.32 56.77,20.32 | D16.C 50.05,23.11 50.04,23.11 | 56.77,20.32 58.42,20.32 59.28,21.18 JP3.1 | R55.2 56.73,20.28 56.77,20.32
CELL10  (via drill 0.51)
  Top 0.203: R30.2 v15.24,20.32 | R20.1 v39.75,18.41
  Top 0.381: 56.77,17.78 v55.88,17.78 53.85,17.78 52.83,18.8 52.45,18.8 | 56.77,17.78 58.42,17.78 59.82,19.18 JP3.2 | R57.2 56.73,17.74 56.77,17.78 | U6.S2 51.94,20.95 52.45,20.45 52.45,18.8 | R17.1 46.99,19.05 47.24,18.8 50.04,18.8 | 50.04,18.8 52.45,18.8 | D17.C 50.05,18.8 50.04,18.8
  Bottom 0.203: v15.24,20.32 15.24,19.3 16.13,18.41 v39.75,18.41 55.24,18.41 v55.88,17.78 | 59.05,18.41 59.82,19.18 JP3.2
CELL11
  Top 0.381: R18.1 46.99,17.78 47.24,18.03 50.04,18.03 | 50.04,18.03 51.82,18.03 52.45,17.4 52.45,16.38 52.96,15.88 U7.S1 53.98,15.88 54.61,15.24 56.77,15.24 | D18.C 50.05,18.03 50.04,18.03 | 56.77,15.24 58.42,15.24 60.36,17.18 JP3.3 | R59.2 56.73,15.2 56.77,15.24
CELL12
  Top 0.254: 50.04,15.49 50.55,15.49 50.93,15.88 U7.S2
  Top 0.381: R21.1 46.99,15.24 47.24,15.49 50.04,15.49 50.05,15.49 D19.C | U7.S2 51.82,15.88 52.45,15.24 52.45,13.59 53.34,12.7 56.77,12.7 | R61.2 56.73,12.66 56.77,12.7 | 56.77,12.7 60.88,12.7 JP5.1
CELL13
  Top 0.381: 56.77,10.16 54.61,10.16 53.98,10.79 U8.S1 52.96,10.79 52.45,11.3 52.45,12.32 51.82,12.95 50.04,12.95 | 56.77,10.16 58.42,10.16 59.04,10.78 JP5.2 | R63.2 56.73,10.12 56.77,10.16 | R22.1 46.99,12.7 47.24,12.95 50.04,12.95 | D20.C 50.05,12.95 50.04,12.95
CELL14
  Top 0.254: 50.04,10.41 50.55,10.41 50.93,10.79 U8.S2
  Top 0.381: R23.1 46.99,10.16 47.24,10.41 50.04,10.41 50.05,10.41 D21.C | U8.S2 51.82,10.79 52.45,10.16 52.45,8.51 53.34,7.62 56.77,7.62 | 56.77,7.62 58.42,7.62 59.58,8.78 JP5.3 | R65.2 56.73,7.58 56.77,7.62
CHG  (via drill 0.51)
  Top 0.203: U1.2 25.73,26.34 v25.4,26.67 | v25.4,29.21 25.4,36.83 25.72,37.15 Q4.2
  Bottom 0.203: v25.4,26.67 v25.4,29.21
CHG_CTL
  Top 0.203: Q3.1 17.78,58.42 19.05,57.15 19.05,48.26 20.32,46.99 27.94,46.99 28.79,46.14 R25.2
  Top 0.254: R25.2 D4.C 30.6,42.17 30.9,41.87 R35.1 D5.C
DSG  (via drill 0.51)
  Top 0.203: Q2.1 46.41,50.23 44.87,48.68 R9.2 38.73,46.99 36.32,44.58 36.32,35.31 34.73,33.72 34.73,28.38 v34.29,27.94 | U1.1 28.91,26.84 29.08,26.67 v29.08,26.16
  Bottom 0.203: v29.08,26.16 33.78,26.16 34.29,26.67 v34.29,27.94
GND  (via drill 0.51, 2.2 pad 4.4)
  Top 0.203: C8.2 16.07,30.48 15.81,30.73 15.81,32.32 v16.51,33.02 | R28.1 58,49.11 v58.42,49.53 | U1.3 24.83,25.84 24,26.67 v24,27.3
  other vias: 19.94,29.4 34.29,38.1 17.78,40.64 27.94,31.75 63.5,52.07 39.37,43.18 39.37,41.27 59.69,49.53 59.69,50.8 59.69,52.07 59.69,53.34 59.69,54.61 58.42,54.61 57.15,49.53 60.96,49.53 60.96,54.61 60.96,55.88 62.23,55.88 63.5,55.88 64.77,55.88 57.15,54.61 25.4,39.37
  pour Top (isolate 0.305): 0,46.99 0,0 67.31,0 67.31,46.99
  pour Bottom (isolate 0.305): 0,46.99 0,0 67.31,0 67.31,46.99
  pour Top (isolate 0.305): 66.04,48.26 66.04,57.15 55.88,57.15 55.88,48.26
  pour Bottom (isolate 0.305): 55.88,57.15 55.88,48.26 66.04,48.26 66.04,57.15
LOAD1  (via drill 0.51)
  other vias: 39.37,49.53 38.1,49.53 36.83,49.53 35.56,49.53 24.13,49.53 22.86,49.53 21.59,49.53 29.21,49.53 27.94,49.53 26.67,49.53 25.4,49.53 34.29,49.53 33.02,49.53 31.75,49.53 30.48,49.53 30.48,50.8 30.48,52.07 30.48,53.34 30.48,54.61 30.48,55.88 30.48,57.15 30.48,58.42 30.48,59.69 30.48,60.96 30.48,62.23 29.21,62.23 27.94,62.23 26.67,62.23 25.4,62.23 24.13,62.23 22.86,62.23 21.59,62.23 31.75,62.23 33.02,62.23 34.29,62.23 35.56,62.23 36.83,62.23 38.1,62.23 39.37,62.23 25.4,50.8 25.4,52.07 25.4,53.34 25.4,54.61 25.4,55.88 25.4,57.15 25.4,58.42 25.4,59.69 25.4,60.96 26.67,50.8 26.67,52.07 26.67,53.34 26.67,54.61 26.67,55.88 26.67,57.15 26.67,58.42 26.67,59.69 26.67,60.96 27.94,50.8 27.94,52.07 27.94,53.34 27.94,54.61 27.94,55.88 27.94,57.15 27.94,58.42 27.94,59.69 27.94,60.96 29.21,50.8 29.21,52.07 29.21,53.34 29.21,54.61 29.21,55.88 29.21,57.15 29.21,58.42 29.21,59.69 29.21,60.96 31.75,50.8 31.75,52.07 31.75,53.34 31.75,54.61 31.75,55.88 31.75,57.15 31.75,58.42 31.75,59.69 31.75,60.96 33.02,50.8 33.02,52.07 33.02,53.34 33.02,54.61 33.02,55.88 33.02,57.15 33.02,58.42 33.02,59.69 33.02,60.96 34.29,50.8 34.29,52.07 34.29,53.34 34.29,54.61 34.29,55.88 34.29,57.15 34.29,58.42 34.29,59.69 34.29,60.96 35.56,50.8 35.56,52.07 35.56,53.34 35.56,54.61 35.56,55.88 35.56,57.15 35.56,58.42 35.56,59.69 35.56,60.96
  pour Top (isolate 0.305): 20.32,62.23 40.64,62.23 40.64,48.26 20.32,48.26
  pour Bottom (isolate 0.305): 20.32,62.23 40.64,62.23 40.64,48.26 20.32,48.26
LOAD2  (via drill 0.51)
  Top 0.203: v50.8,49.53 49.53,49.53 48.68,48.68 R27.1 R9.1 | Q2.3 46.41,60.27 44.45,62.23 C35.1
  other vias: 49.53,57.15 49.53,58.42 49.53,59.69 49.53,60.96 48.26,60.96 46.99,60.96 45.72,60.96 44.45,60.96 50.8,57.15 50.8,58.42 50.8,59.69 50.8,60.96 50.8,55.88 52.07,55.88 52.07,54.61 50.8,54.61 52.07,49.53 50.04,50.8 50.04,52.07 50.04,53.34 52.07,57.15 52.07,58.42 52.07,59.69 52.07,60.96 53.34,60.96 53.34,59.69 53.34,58.42 53.34,57.15 53.34,55.88 53.34,54.61 53.34,49.53
  pour Top (isolate 0.305): 54.61,48.26 54.61,62.23 43.18,62.23 43.18,55.88 49.53,55.88 49.53,48.26
  pour Bottom (isolate 0.305): 43.18,62.23 54.61,62.23 54.61,48.26 49.53,48.26 49.53,55.88 43.18,55.88
LOAD-  (via drill 0.51, 2.2 pad 4.4)
  Top 0.203: C36.2 13.97,62.23 11.43,59.69 11.43,55.88 | D5.A 26.36,41.6 27.09,42.33 R25.1 27.09,45.3 26.67,45.72 17.78,45.72 16.51,46.99 16.51,48.26
  other vias: 3.81,52.07 6.35,54.61 7.62,54.61 7.62,53.34 7.62,52.07 7.62,50.8 7.62,49.53 6.35,49.53 8.89,54.61 8.89,53.34 8.89,52.07 8.89,50.8 8.89,49.53 10.16,54.61 10.16,53.34 10.16,52.07 10.16,50.8 10.16,49.53 11.43,54.61 11.43,53.34 11.43,52.07 11.43,50.8 11.43,49.53 12.7,50.8 13.97,50.8 15.24,50.8 16.51,50.8 12.7,49.53 13.97,49.53 15.24,49.53 16.51,49.53
  pour Top (isolate 0.305): 1.27,55.88 17.78,55.88 17.78,48.26 1.27,48.26
  pour Bottom (isolate 0.305): 1.27,55.88 17.78,55.88 17.78,48.26 1.27,48.26
N$1
  Top 0.254: 47.75,41.66 50.42,41.66 50.99,42.23 U2.G1
  Top 0.381: R37.1 47.12,41.91 47.37,41.66 47.75,41.66 47.74,41.66 D8.A
N$2
  Top 0.254: Q4.3 R36.2
N$3
  Top 0.203: SJ2.1 R32.2
N$4
  Top 0.381: U2.D1 54.04,42.23 54.36,41.91 R29.1
N$5
  Top 0.381: R39.1 47.12,39.37 47.37,39.12 47.75,39.12 | 47.75,39.12 50.8,39.12 51.25,39.57 U2.G2 | D9.A 47.74,39.12 47.75,39.12
N$6
  Top 0.203: C36.1 19.05,62.23 20.32,63.5 40.64,63.5 41.91,62.23 C35.2
N$7
  Top 0.254: D4.A 32.9,42.17 32.6,41.87 R35.2 R36.1
N$8
  Top 0.381: U2.D2 53.65,39.69 53.98,39.37 R38.1
N$9
  Top 0.203: C38.1 C37.2
N$10
  Top 0.203: SJ1.3 13.51,25.86 14.48,24.89 14.48,21.97 14.1,21.59 R2.2
N$11
  Top 0.203: SJ1.1 11.89,26.21 13.55,24.55 R1.2
N$12
  Top 0.254: 47.75,36.58 50.42,36.58 50.99,37.15 U3.G1
  Top 0.381: R40.1 47.12,36.83 47.37,36.58 47.75,36.58 47.74,36.58 D10.A
N$13
  Top 0.381: U3.D1 54.04,37.15 54.36,36.83 R41.1
N$14
  Top 0.381: R42.1 47.12,34.29 47.37,34.04 47.75,34.04 | 47.75,34.04 50.93,34.04 51.25,34.36 U3.G2 | D11.A 47.74,34.04 47.75,34.04
N$16
  Top 0.381: U3.D2 53.65,34.61 53.98,34.29 R43.1
N$18
  Top 0.254: 47.75,31.5 50.42,31.5 50.99,32.06 U4.G1
  Top 0.381: R44.1 47.12,31.75 47.37,31.5 47.75,31.5 47.74,31.5 D12.A
N$19
  Top 0.381: U4.D1 54.04,32.06 54.36,31.75 R45.1
N$20
  Top 0.381: R46.1 47.12,29.21 47.37,28.96 47.75,28.96 | 47.75,28.96 50.93,28.96 51.25,29.28 U4.G2 | D13.A 47.74,28.96 47.75,28.96
N$21
  Top 0.381: U4.D2 53.65,29.79 54.23,29.21 R47.1
N$23
  Top 0.381: U5.D1 54.04,26.98 54.36,26.67 R49.1
N$25
  Top 0.254: 47.75,26.42 50.42,26.42 50.99,26.98 U5.G1
  Top 0.381: R48.1 47.12,26.67 47.37,26.42 47.75,26.42 47.74,26.42 D14.A
N$26
  Top 0.381: U5.D2 53.65,24.58 54.1,24.13 R51.1
N$27
  Top 0.381: R50.1 47.12,24.13 47.37,23.88 47.75,23.88 | 47.75,23.88 50.8,23.88 51.25,24.33 U5.G2 | D15.A 47.74,23.88 47.75,23.88
N$28
  Top 0.203: SJ3.1 R33.2
N$30
  Top 0.203: U1.7 30.44,23.84 30.99,24.38 30.99,26.92 30.73,27.18 30.73,30.23 30.48,30.48 C7.1
N$32
  Top 0.203: S1.2 22.86,40.64 21.59,41.91 R26.1
N$33
  Top 0.203: R34.2 SJ4.1
N$34
  Top 0.203: C30.2 R27.2 C29.2
N$35
  Top 0.203: C30.1 R28.2 C31.1
N$37
  Top 0.381: U6.D1 54.04,21.91 54.36,21.59 R53.1
N$38
  Top 0.254: 47.75,21.34 50.42,21.34 50.99,21.91 U6.G1
  Top 0.381: R52.1 47.12,21.59 47.37,21.34 47.75,21.34 47.74,21.34 D16.A
N$39
  Top 0.254: 47.75,20.57 50.42,20.57 50.99,20
  Top 0.381: R54.1 47.12,20.32 47.37,20.57 47.75,20.57 47.74,20.57 D17.A | U6.G2 50.99,20
N$41
  Top 0.381: U6.D2 53.65,19.37 53.98,19.05 R55.1
N$42
  Top 0.254: 47.75,16.26 50.42,16.26 50.99,16.82 U7.G1
  Top 0.381: R56.1 47.12,16.51 47.37,16.26 47.75,16.26 47.74,16.26 D18.A
N$43
  Top 0.381: U7.D1 54.04,16.82 54.36,16.51 R57.1
N$44
  Top 0.381: R58.1 47.12,13.97 47.37,13.72 47.75,13.72 | 47.75,13.72 50.8,13.72 51.25,14.17 U7.G2 | D19.A 47.74,13.72 47.75,13.72
N$46
  Top 0.381: U7.D2 53.65,14.42 54.1,13.97 R59.1
N$47
  Top 0.254: 47.75,11.18 50.42,11.18 50.99,11.74 U8.G1
  Top 0.381: R60.1 47.12,11.43 47.37,11.18 47.75,11.18 47.74,11.18 D20.A
N$50
  Top 0.381: U8.D1 54.04,11.74 54.36,11.43 R61.1
N$51
  Top 0.381: R62.1 47.12,8.89 47.37,8.64 47.75,8.64 | 47.75,8.64 50.8,8.64 51.25,9.09 U8.G2 | D21.A 47.74,8.64 47.75,8.64
N$52
  Top 0.381: U8.D2 53.65,9.34 54.1,8.89 R63.1
N$53
  Top 0.381: R64.1 47.12,7.62 47.37,7.87 47.75,7.87 | 47.75,7.87 50.67,7.87 51.25,7.3 U9.G1 | D22.A 47.74,7.87 47.75,7.87
N$54
  Top 0.381: U9.D1 54.04,6.67 54.36,6.35 R65.1
N$57
  Top 0.203: R67.1 D23.A
N$58
  Top 0.203: SJ5.1 R67.2
PACK+  (via drill 0.51, 2.2 pad 4.4)
  Top 0.203: Q1.3 16.68,29.04 v16.51,29.21 | R3.1 v19.05,12.7
  Top 0.381: U9.S1 53.98,5.71 54.61,5.08 54.61,4.45 | 54.61,4.45 54.23,4.06 50.67,4.06 50.42,4.32 50.42,4.83 50.16,5.08 | 54.61,4.45 60.33,4.45 60.96,5.08 JP5.4 | R24.1 46.57,5.5 46.99,5.08 50.16,5.08 | D22.C 50.05,5.2 50.16,5.08
  Bottom 0.203: v16.51,29.21 12.7,25.4 12.7,13.97 | 12.7,13.97 3.17,13.97 1.91,15.24 1.91,43.81 3.81,45.72 17.78,45.72 19.05,46.99 19.05,63.5 | 12.7,13.97 17.78,13.97 v19.05,12.7
  Bottom 0.762: JP5.4 62.66,6.78 63.5,7.62 63.5,45.72 62.23,46.99 56.26,46.99 55.37,47.88 55.37,63.75
  other vias: 63.5,66.04 3.81,66.04 59.69,64.77 58.42,64.77 57.15,64.77 55.88,64.77 54.61,64.77 53.34,64.77 59.69,66.04 58.42,66.04 57.15,66.04 55.88,66.04 54.61,66.04 53.34,66.04 59.69,67.31 58.42,67.31 57.15,67.31 55.88,67.31 54.61,67.31 53.34,67.31 59.69,68.58 58.42,68.58 57.15,68.58 55.88,68.58 54.61,68.58 53.34,68.58 52.07,64.77 50.8,64.77 49.53,64.77 48.26,64.77 46.99,64.77 45.72,64.77 52.07,66.04 50.8,66.04 49.53,66.04 48.26,66.04 46.99,66.04 45.72,66.04 52.07,67.31 50.8,67.31 49.53,67.31 48.26,67.31 46.99,67.31 45.72,67.31 52.07,68.58 50.8,68.58 49.53,68.58 48.26,68.58 46.99,68.58 45.72,68.58 44.45,64.77 43.18,64.77 41.91,64.77 40.64,64.77 39.37,64.77 38.1,64.77 44.45,66.04 43.18,66.04 41.91,66.04 40.64,66.04 39.37,66.04 38.1,66.04 44.45,67.31 43.18,67.31 41.91,67.31 40.64,67.31 39.37,67.31 38.1,67.31 44.45,68.58 43.18,68.58 41.91,68.58 40.64,68.58 39.37,68.58 38.1,68.58 36.83,64.77 35.56,64.77 34.29,64.77 33.02,64.77 31.75,64.77 30.48,64.77 36.83,66.04 35.56,66.04 34.29,66.04 33.02,66.04 31.75,66.04 30.48,66.04 36.83,67.31 35.56,67.31 34.29,67.31 33.02,67.31 31.75,67.31 30.48,67.31 36.83,68.58 35.56,68.58 34.29,68.58 33.02,68.58 31.75,68.58 30.48,68.58 29.21,66.04 27.94,66.04 26.67,66.04 25.4,66.04 24.13,66.04 22.86,66.04 29.21,67.31 27.94,67.31 26.67,67.31 25.4,67.31 24.13,67.31 22.86,67.31 29.21,68.58 27.94,68.58 26.67,68.58 25.4,68.58 24.13,68.58 22.86,68.58 21.59,66.04 20.32,66.04 19.05,66.04 17.78,66.04 16.51,66.04 15.24,66.04 21.59,67.31 20.32,67.31 19.05,67.31 17.78,67.31 16.51,67.31 15.24,67.31 21.59,68.58 20.32,68.58 19.05,68.58 17.78,68.58 16.51,68.58 15.24,68.58 13.97,66.04 12.7,66.04 11.43,66.04 10.16,66.04 8.89,66.04 7.62,66.04 13.97,67.31 12.7,67.31 11.43,67.31 10.16,67.31 8.89,67.31 7.62,67.31 13.97,68.58 12.7,68.58 11.43,68.58 10.16,68.58 8.89,68.58 7.62,68.58 8.89,64.77 10.16,64.77 7.62,64.77 13.97,64.77 12.7,64.77 11.43,64.77 21.59,64.77 20.32,64.77 19.05,64.77 17.78,64.77 16.51,64.77 15.24,64.77 29.21,64.77 27.94,64.77 26.67,64.77 25.4,64.77 24.13,64.77 22.86,64.77 59.69,69.85 58.42,69.85 57.15,69.85 55.88,69.85 54.61,69.85 53.34,69.85 52.07,69.85 50.8,69.85 49.53,69.85 48.26,69.85 46.99,69.85 45.72,69.85 44.45,69.85 43.18,69.85 41.91,69.85 40.64,69.85 39.37,69.85 38.1,69.85 36.83,69.85 35.56,69.85 34.29,69.85 33.02,69.85 31.75,69.85 30.48,69.85 29.21,69.85 27.94,69.85 26.67,69.85 25.4,69.85 24.13,69.85 22.86,69.85 21.59,69.85 20.32,69.85 19.05,69.85 17.78,69.85 16.51,69.85 15.24,69.85 13.97,69.85 12.7,69.85 11.43,69.85 10.16,69.85 8.89,69.85 7.62,69.85
  pour Bottom (isolate 0.305): 1.27,69.85 6.35,69.85 7.62,71.12 59.69,71.12 60.96,69.85 66.04,69.85 66.04,63.5 1.27,63.5
  pour Top (isolate 0.305): 1.27,69.85 6.35,69.85 7.62,71.12 59.69,71.12 60.96,69.85 66.04,69.85 66.04,63.5 1.27,63.5
REGOUT  (via drill 0.51)
  Top 0.203: v31.24,31.62 31.24,30.48 | U1.8 30.96,23.34 31.62,24 31.62,26.92 31.24,27.3 31.24,30.48 | v8.89,31.11 12.06,31.11 12.7,30.48 SJ1.2 | C1.1 31.24,30.48 | JP10.2 3.17,19.05 2.03,17.91 SJ5.2
  Bottom 0.203: JP10.2 2.54,20.32 2.54,29.21 4.45,31.11 v8.89,31.11 17.14,31.11 18.1,32.07 21.59,32.07 22.54,33.02 29.84,33.02 v31.24,31.62
REGSRC
  Top 0.203: C8.1 18.63,29.63 18.78,29.48 Q1.2 18.78,28.08 18.92,27.94 19.43,27.94 19.68,27.69 19.68,26.48 20,26.16 22.86,26.16 23.37,25.65 23.37,25.15 25.67,22.84 U1.9
SCL  (via drill 0.51)
  Top 0.203: v20.32,31.18 20.38,31.24 22.61,31.24 23.69,30.16 23.69,28.89 25.08,27.5 29.4,27.5 29.72,27.18 29.72,26.92 29.97,26.67 29.97,25.02 29.79,24.84 U1.5 | R1.1 JP10.4
  Bottom 0.203: v20.32,31.18 19.75,31.18 19.18,30.61 14.1,30.61 7.62,24.13 JP10.4
SDA  (via drill 0.51)
  Top 0.203: v10.16,21.59 R2.1 | U1.4 24.19,25.34 23.88,25.65 23.88,26.04 23.11,26.8 23.11,29.84 22.99,29.97 22.73,30.23 22.67,30.29 v21.59,30.29
  Bottom 0.203: v21.59,30.29 19.62,30.29 19.43,30.1 14.86,30.1 10.16,25.4 v10.16,21.59 JP10.3
SRN  (via drill 0.51)
  Top 0.203: U1.43 35.1,26.34 35.18,26.42 35.18,33.4 36.83,35.05 36.83,43.18 v38.1,44.45 | v55.88,44.45 57.15,44.45 58,45.3 C31.2
  Bottom 0.203: v55.88,44.45 v38.1,44.45
SRP
  Top 0.203: U1.42 35.37,25.84 35.69,26.16 35.69,33.15 37.34,34.8 37.34,42.42 40.64,45.72 C29.1
TS1  (via drill 0.51)
  Top 0.203: U1.6 30.18,24.34 30.48,24.64 30.48,26.8 30.23,27.05 30.23,27.94 | 30.23,27.94 30.23,28.96 29.97,29.21 C2.1 | 30.23,27.94 25.4,27.94 24.13,29.21 24.13,30.48 21.59,33.02 v20.32,33.02 | JP8.2 SJ2.2 12.19,41.4 12.7,41.91 R26.2
  Bottom 0.203: v20.32,33.02 13.97,39.37 JP8.2
TS2  (via drill 0.51)
  Top 0.203: U1.13 23.61,20.84 23.3,21.14 16.19,21.14 15.49,21.84 15.49,24.13 | JP6.2 SJ3.2 | 15.49,24.13 15.49,25.65 15.24,25.91 v15.24,33.02 | C9.1 15.49,24.13
  Bottom 0.203: v15.24,33.02 15.24,35.56 13.97,36.83 JP6.2
TS3
  Top 0.203: JP9.2 SJ4.2 12.19,32.89 12.7,32.38 13.34,32.38 14.73,30.99 14.73,25.53 14.99,25.27 14.99,21.34 14.35,20.7 14.35,19.56 14.86,19.05 15.24,19.05 | C10.1 15.24,19.05 | U1.18 25.45,18.34 23.5,16.38 15.88,16.38 15.24,17.02 15.24,19.05
VC0
  Top 0.203: U1.41 35.56,25.34 36.2,25.97 36.2,32.64 37.91,34.35 37.91,41.59 38.48,42.16 42.8,42.16 | R4.2 44.07,44.45 43.81,44.2 43.81,42.55 43.43,42.16 42.8,42.16 | C11.2 42.76,42.2 42.8,42.16
VC1
  Top 0.203: U1.40 35.7,24.84 36.64,25.78 36.64,32.45 38.35,34.16 38.35,39.88 38.73,40.26 41.02,40.26 | R5.2 R37.2 44.07,41.91 43.81,41.66 43.81,40.51 43.56,40.26 42.8,40.26 | C13.2 41.06,40.22 41.02,40.26 | 41.02,40.26 42.8,40.26 | C12.1 42.76,40.3 42.8,40.26
VC2
  Top 0.203: 42.8,38.35 43.56,38.35 43.81,38.61 43.81,39.12 44.07,39.37 R39.2 R6.2 | U1.39 35.9,24.34 37.08,25.53 37.08,32.26 38.8,33.97 38.8,37.78 39.37,38.35 41.02,38.35 | C13.1 42.76,38.39 42.8,38.35 | 42.8,38.35 41.02,38.35 | C14.2 41.06,38.31 41.02,38.35
VC3
  Top 0.203: U1.38 36.03,23.84 37.53,25.34 37.53,32.07 39.24,33.78 39.24,36.07 39.62,36.45 41.15,36.45 | R10.2 R40.2 44.2,36.83 43.81,36.45 42.8,36.45 | C14.1 42.76,36.49 42.8,36.45 | 42.8,36.45 41.15,36.45 | C15.2 41.06,36.36 41.15,36.45
VC4
  Top 0.203: 42.8,34.67 43.56,34.67 43.94,34.29 R42.2 R11.2 | 42.8,34.67 41.02,34.67 | 41.02,34.67 40.01,34.67 39.69,34.35 39.69,33.59 37.97,31.88 37.97,25.15 36.17,23.34 U1.37 | C15.1 42.76,34.71 42.8,34.67 | 41.02,34.67 41.06,34.63 C16.2
VC5
  Top 0.203: 35.5,22.84 U1.36 32.24,22.84 31.63,22.23 D3.A | 35.5,22.84 36.3,22.84 38.42,24.96 38.42,31.69 39.37,32.64 42.8,32.64 | 35.48,22.86 35.5,22.84 | 42.8,32.64 43.69,32.64 44.07,33.02 R12.2 R44.2 | C16.1 42.76,32.68 42.8,32.64
VC5B
  Top 0.203: U1.35 36.44,22.34 38.86,24.77 38.86,30.48 39.12,30.73 41.02,30.73 | C24.2 41.06,30.7 41.02,30.73 | 41.02,30.73 42.55,30.73 42.76,30.95 R13.2
VC5X  (via drill 0.51)
  Top 0.203: C34.1 21.59,24.13 | C33.2 21.59,24.13 | Q1.1 18.78,26.27 18.63,26.12 R31.1 C9.2 | D3.C 29.33,14.72 30.48,15.88 v30.48,21.59 29.73,22.34 U1.10 25.48,22.34 23.69,24.13 21.59,24.13 | C24.1 42.76,29.17 42.42,28.83 41.27,28.83 41.06,28.61 C17.2 v39.75,27.94 | C9.2 21.59,24.13 | C9.2 C4.2 | R33.1 20.32,36.83 21.59,35.56 v21.59,34.29
  Bottom 0.203: v30.48,21.59 30.48,22.86 31.75,24.13 39.75,24.13 | 39.75,24.13 55.88,24.13 57.15,25.4 57.15,34.16 56.26,35.05 22.35,35.05 v21.59,34.29 21.72,34.42 | v39.75,27.94 39.75,24.13
VC6
  Top 0.203: U1.34 36.57,21.84 39.31,24.57 39.31,26.48 39.75,26.92 41.15,26.92 | R19.2 R46.2 44.07,29.21 43.81,28.96 43.81,28.19 43.56,27.94 C17.1 42.76,27.27 42.42,26.92 41.15,26.92 | C18.2 41.06,26.84 41.15,26.92
VC7
  Top 0.203: U1.33 36.71,21.34 39.5,24.13 C19.2 41.06,24.8 41.27,25.02 42.42,25.02 42.76,25.36 C18.1 43.43,26.04 44.07,26.67 R48.2 R14.2
VC8
  Top 0.203: U1.32 36.84,20.84 39.12,23.11 41.02,23.11 | R15.2 R50.2 C19.1 42.76,23.46 42.42,23.11 41.02,23.11 | C20.2 41.06,23.07 41.02,23.11
VC9
  Top 0.203: 42.8,21.21 43.43,21.21 43.81,21.59 R52.2 R16.2 | C20.1 42.76,21.25 42.8,21.21 | U1.31 38.5,20.34 39.37,21.21 41.02,21.21 | 41.02,21.21 42.8,21.21 | C21.2 41.06,21.17 41.02,21.21
VC10
  Top 0.203: D2.A 32.13,11.43 32.32,11.62 32.32,14.61 32.07,14.86 32.07,19.62 32.29,19.84 U1.30 39.6,19.84 40.01,19.43 42.67,19.43 | 42.67,19.43 43.56,19.43 43.94,19.05 R17.2 R54.2 | C21.1 42.76,19.52 42.67,19.43
VC10B
  Top 0.203: U1.29 37.56,19.34 39.5,17.4 41.02,17.4 | R20.2 42.76,17.74 42.42,17.4 41.02,17.4 | C22.2 41.06,17.36 41.02,17.4
VC10X  (via drill 0.51)
  Top 0.203: D2.C 28.83,11.43 28.64,11.62 v28.64,12.7 28.64,14.67 29.34,15.37 29.34,19.3 28.8,19.84 U1.15 23.65,19.84 22.86,19.05 21.59,19.05 | C33.1 21.59,19.05 | 21.59,19.05 C10.2 | C32.2 21.59,19.05 | R30.1 C10.2 | C10.2 C6.2 | v39.75,14.61 C25.2 41.06,15.28 41.27,15.49 42.55,15.49 42.76,15.71 C22.1 | R34.1 v20.32,34.29
  Bottom 0.203: 28.64,12.76 v28.64,12.7 30.54,14.61 v39.75,14.61 57.02,14.61 57.78,15.37 57.78,34.29 56.52,35.56 21.59,35.56 v20.32,34.29
VC11
  Top 0.203: U1.28 37.29,18.84 38.35,17.78 38.35,13.97 38.73,13.59 41.02,13.59 | R18.2 R56.2 44.2,16.51 43.81,16.13 43.81,14.99 43.43,14.61 C25.1 42.76,13.93 42.42,13.59 41.02,13.59 | C23.2 41.06,13.55 41.02,13.59
VC12
  Top 0.203: U1.27 37.1,18.34 37.91,17.53 37.91,12.76 38.99,11.68 41.02,11.68 | R21.2 R58.2 44.07,13.97 43.81,13.72 43.81,13.08 43.43,12.7 C23.1 42.76,12.03 42.42,11.68 41.02,11.68 | C26.2 41.06,11.64 41.02,11.68
VC13
  Top 0.203: U1.26 36.9,17.84 37.47,17.27 37.47,10.29 37.97,9.78 41.02,9.78 | R22.2 R60.2 44.07,11.43 43.43,10.79 C26.1 42.76,10.12 42.42,9.78 41.02,9.78 | C27.2 41.06,9.74 41.02,9.78
VC14
  Top 0.203: U1.25 36.7,17.34 37.02,17.02 37.02,8.83 37.97,7.87 41.02,7.87 41.06,7.83 | R23.2 R62.2 C27.1 42.76,8.22 42.38,7.83 41.06,7.83 | C28.2 41.06,7.83
VC15
  Top 0.203: U1.24 36.25,16.84 36.58,16.51 36.58,8.95 | 36.58,8.95 36.58,6.92 37.47,6.03 42.8,6.03 | D1.A 36.51,8.89 36.58,8.95 | 42.8,6.03 43.75,6.03 44.07,6.35 R24.2 R64.2 | C28.1 42.76,6.07 42.8,6.03

### Text on the board
Bottom: V2.0
tPlace: DANGER | HIGH VOLTAGE | LOAD | + | + | PACK | - | - | BOOT | - | 1 | Thermistors | TS1 | 2 | 3 | TS2 | TS3 | 4 | 5 | SJ1 | 6 | 7 | GND | 8 | SCL | SDA | 9 | 10 | 3.3V | 11 | ALERT | Power | 12 | 13 | SJ5 | 14 | 15 | bq76940 / E-Bike | Battery Management System | N. Seidle
bPlace: HOT! | - | 1 | TS1 | 2 | 3 | TS2 | TS3 | 4 | 5 | 6 | 7 | GND | 8 | SCL | CELLS | SDA | 9 | 10 | 3.3V | 11 | ALERT | 12 | 13 | 14 | 15 | Insulate These Connections! | DANGER | HIGH VOLTAGE